# Altium project RGV_PCBA_1V21.PrjPcb (part 1 of 2)
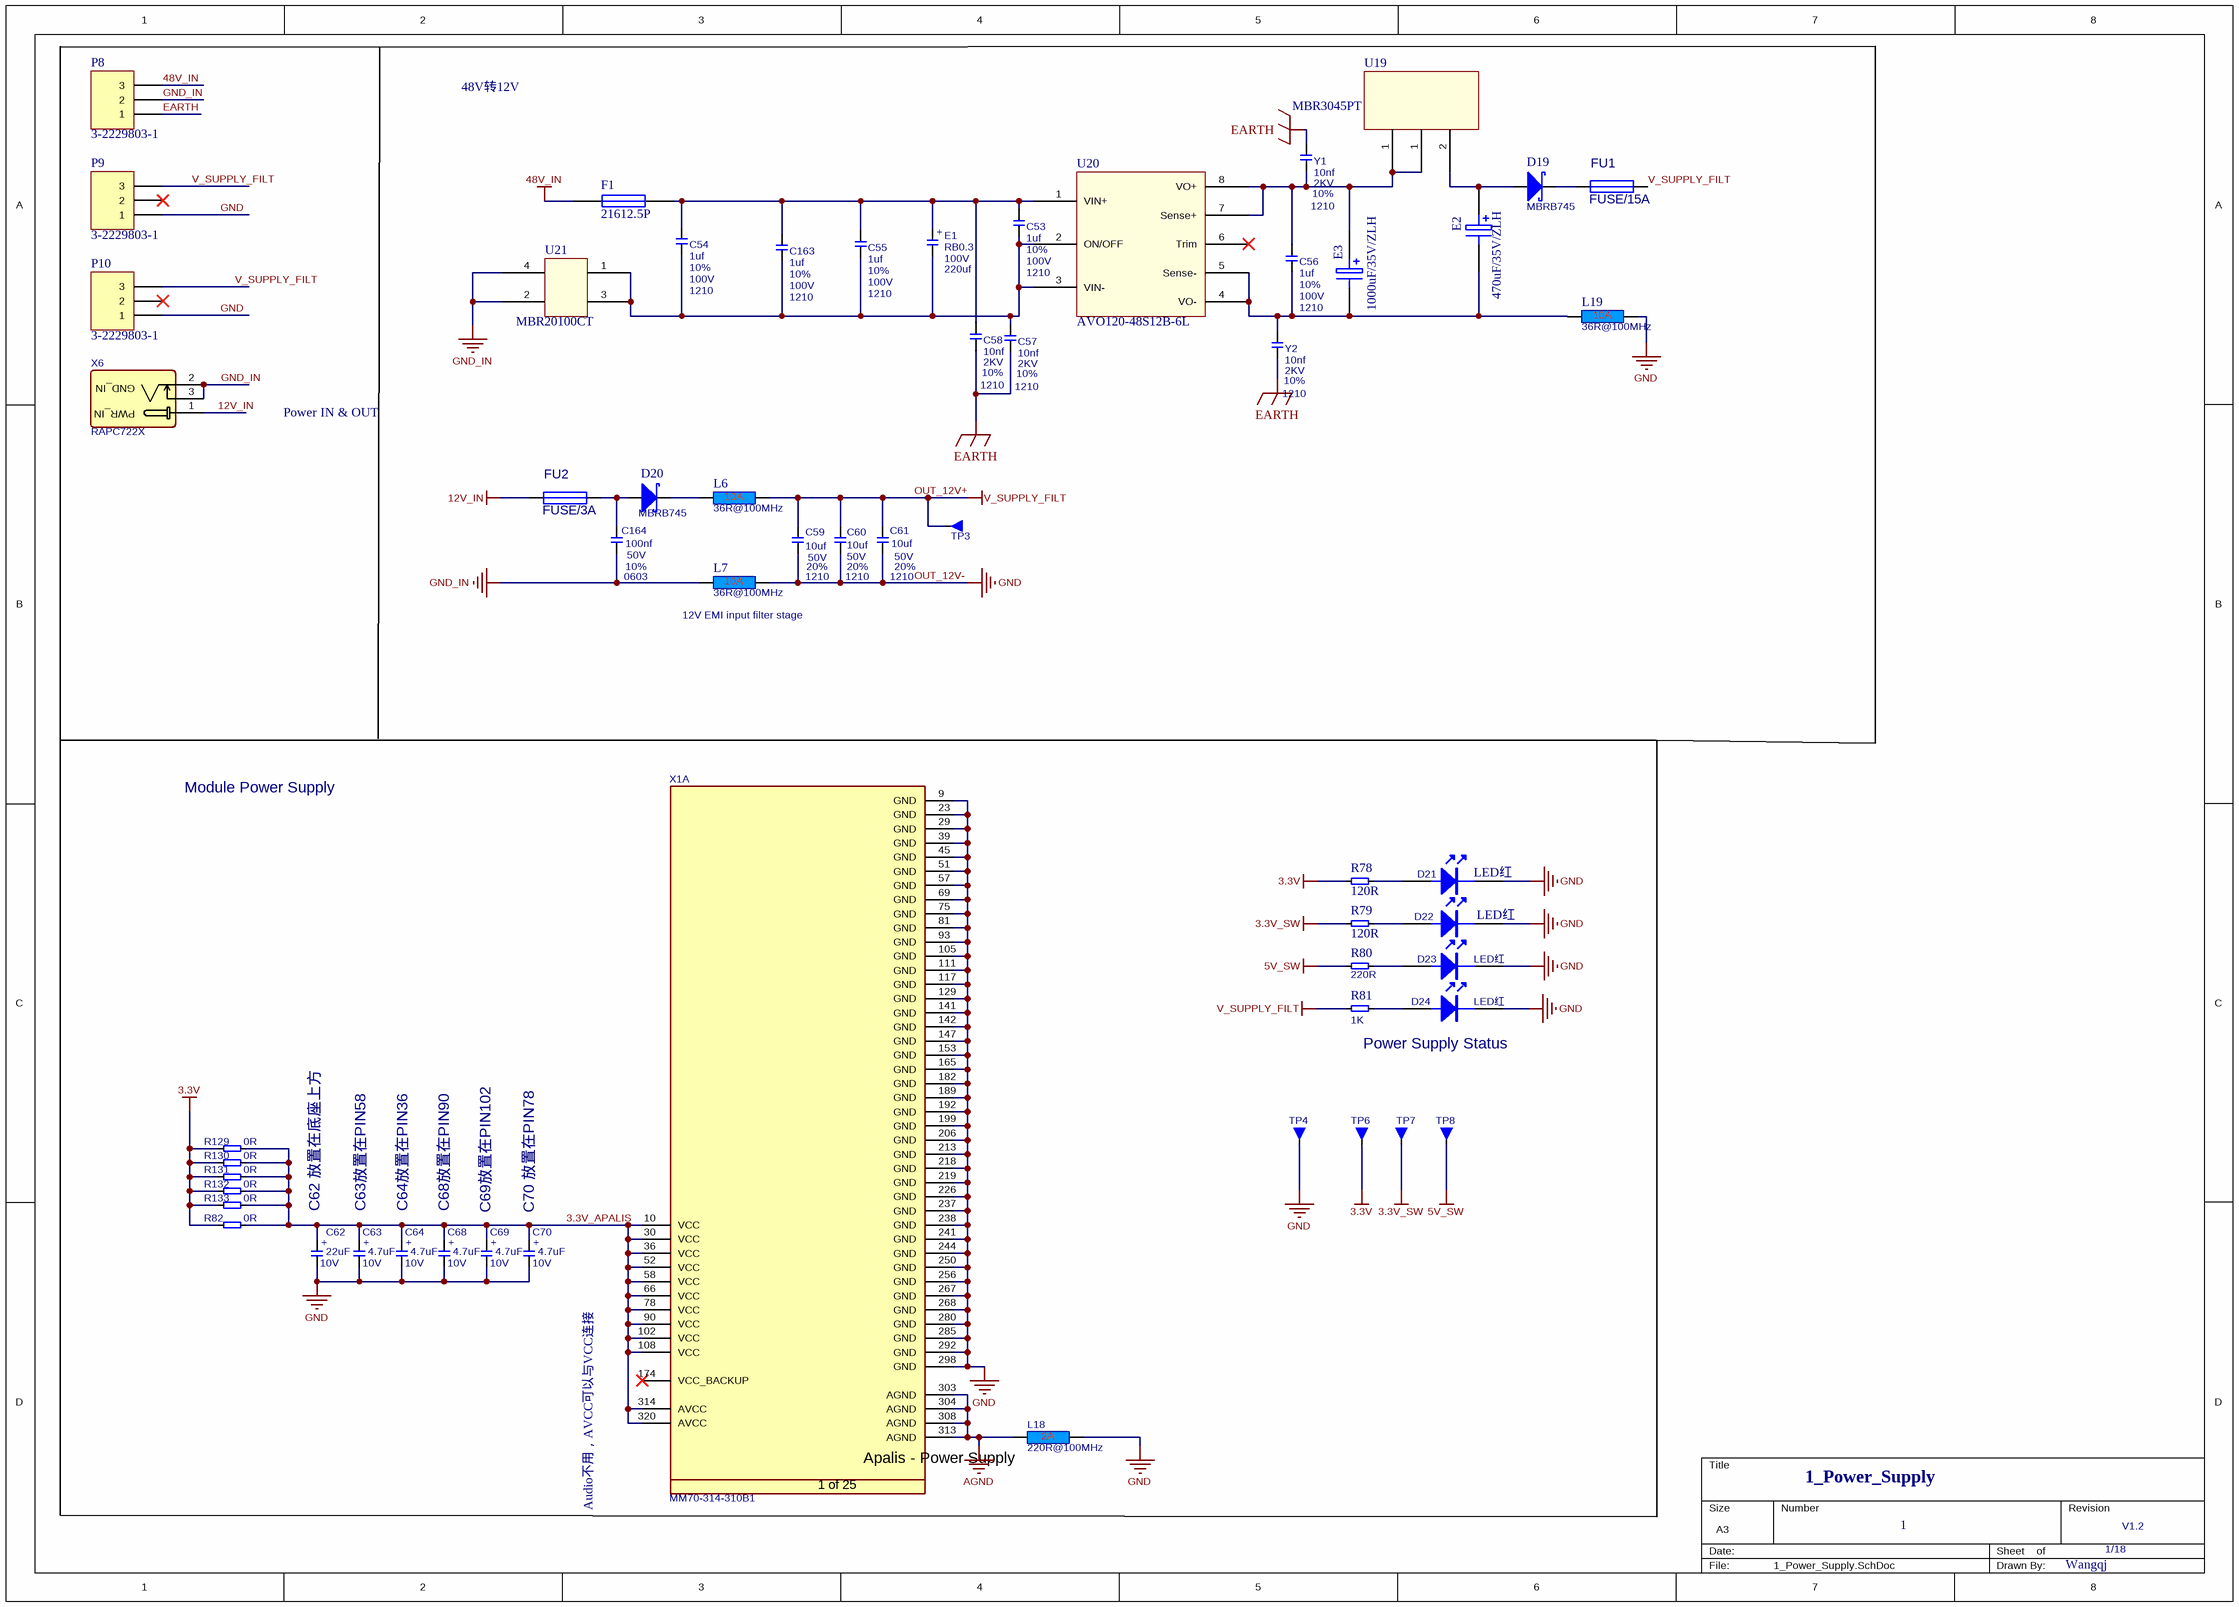
[diagram p0: 1_Power_Supply.SchDoc]
18 sheets, 529 parts. Net scope: global (net labels, ports and power ports of the same name join across sheets).
Board file: RGV_Control_1V21.PcbDoc
Sheets:
  1_Power_Supply.SchDoc
  2_Power_Switch.SchDoc
  3_RTC.SchDoc
  4_SDCard.SchDoc
  5_Ethernet.SchDoc
  6_CAN.SchDoc
  7_UART&RS485.SchDoc
  8_USB_Hub.SchDoc
  9_USB_Connectors.SchDoc
  10_RS232_1.SchDoc
  11_RS232_2.SchDoc
  12_NB-IOT_Core.SchDoc
  13_NB-IOT_Peripheral.SchDoc
  14_GPIOs_1.SchDoc
  15_GPIOs_2.SchDoc
  16_Analog&Audio.SchDoc
  17_I2C&SPI&SATA.SCHDOC
  18_VGA.SchDoc

## Sheet 1_Power_Supply.SchDoc: Apalis Evaluation Board 1.1
size A3; Organization: Toradex AG; Address1: Altsagenstrasse 5; Address2: Horw; Address3: 6048; Address4: Switzerland; DocumentNumber: 3; Revision: V1.1; SheetNumber: 3; SheetTotal: 32; PageSetup: Record=PageOptions|CenterHorizontal=True|CenterVertical=True|PrintScale=0.73|XCorrection=1.00|YCorrection=1.00|PrintKind=0|BorderSize=5000000|LeftOffset=0|BottomOffset=0|Orientation=2|PaperLength=1000|PaperWidth=1000|Scale=100|PaperSource=7|PrintQuality=-4|MediaType=1|DitherType=10|PaperKind=A4|PrintScaleMode=1

### Parts
C53  value 1uf  Tolerance: 10%  Rating: 100V  [1210]  (hidden comment: 1uf-100V-10%-1210)
C54  value 1uf  Tolerance: 10%  Rating: 100V  [1210]  (hidden comment: 1uf-100V-10%-1210)
C55  value 1uf  Tolerance: 10%  Rating: 100V  [1210]  (hidden comment: 1uf-100V-10%-1210)
C56  value 1uf  Tolerance: 10%  Rating: 100V  [1210]  (hidden comment: 1uf-100V-10%-1210)
C57  value 10nf  Tolerance: 10%  Rating: 2KV  [1210]  (hidden comment: 10nf-2KV-10%-1210)
C58  value 10nf  Tolerance: 10%  Rating: 2KV  [1210]  (hidden comment: 10nf-2KV-10%-1210)
C59  value 10uf  Tolerance: 20%  Rating: 50V  Footprint: 1210  [CAPC3225X160N]  (hidden comment: 10uf-50V-20%-1210-X5R)
C60  value 10uf  Tolerance: 20%  Rating: 50V  Footprint: 1210  [CAPC3225X160N]  (hidden comment: 10uf-50V-20%-1210-X5R)
C61  value 10uf  Tolerance: 20%  Rating: 50V  Footprint: 1210  [CAPC3225X160N]  (hidden comment: 10uf-50V-20%-1210-X5R)
C62  Rating: 10V  [CAPMP3528X210N]  (hidden comment: 22uF)
C63  Rating: 10V  [T_CAPMP3216X180N]  (hidden comment: 4.7uF)
C64  Rating: 10V  [T_CAPMP3216X180N]  (hidden comment: 4.7uF)
C68  Rating: 10V  [T_CAPMP3216X180N]  (hidden comment: 4.7uF)
C69  Rating: 10V  [T_CAPMP3216X180N]  (hidden comment: 4.7uF)
C70  Rating: 10V  [T_CAPMP3216X180N]  (hidden comment: 4.7uF)
C163  value 1uf  Tolerance: 10%  Rating: 100V  [1210]  (hidden comment: 1uf-100V-10%-1210)
C164  value 100nf  Tolerance: 10%  Rating: 50V  Footprint: 0603  [T_CAPC0603X33N]  (hidden comment: 100nf-50V-10%-0603-X7R)
D19  Manufacturer Part No.: MBRB745  [T_VISHAY_MBRB735PBF]  (hidden comment: MBRB735PBF)
D20  MBRB745  [T_VISHAY_MBRB735PBF]
D21  LED红  [LC-0805_LED_S3]
D22  LED红  [LC-0805_LED_S3]
D23  LED红  [LC-0805_LED_S3]
D24  LED红  [LC-0805_LED_S3]
E1  value 220uf  Footprint: RB0.3  Rating: 100V  [5*13]  (hidden comment: 220uf-100V-RB0.3)
E2  470uF/35V/ZLH  [RB0.3]
E3  1000uF/35V/ZLH  [5*13]
F1  21612.5P  [RAD0.3]
FU1  FUSE/15A  [FUSE-1808-3A]
FU2  FUSE/3A  [FUSE-1808-3A]
L6  36R@100MHz  [T_Laird_35F0121-0SR-10]
L7  36R@100MHz  [T_Laird_35F0121-0SR-10]
L18  220R@100MHz  [INDC1608X95N]
L19  36R@100MHz  [T_Laird_35F0121-0SR-10]
P8  3-2229803-1  [3-2229803-1]
P9  3-2229803-1  [3-2229803-1]
P10  3-2229803-1  [3-2229803-1]
R78  120R  [T_RESC0603X30N]
R79  120R  [T_RESC0603X30N]
R80  220R  [T_RESC0603X30N]
R81  1K  [T_RESC0603X30N]
R82  0R  [T_RESC3216X760N]
R129  0R  [T_RESC3216X760N]
R130  0R  [T_RESC3216X760N]
R131  0R  [T_RESC3216X760N]
R132  0R  [T_RESC3216X760N]
R133  0R  [T_RESC3216X760N]
TP3  Testpin  [T_TP-THT]  (value not drawn)
TP4  Testpin  [T_TP-THT]  (value not drawn)
TP6  Testpin  [T_TP-THT]  (value not drawn)
TP7  Testpin  [T_TP-THT]  (value not drawn)
TP8  Testpin  [T_TP-THT]  (value not drawn)
U19  MBR3045PT  [TO-3P]
U20  AVO120-48S12B-6L  [AVO120-48S12B-6L]
U21  MBR20100CT  [TO-220]
X1  Manufacturer Part No.: MM70-314-310B1  [T_JAE_MM70-314-310B1]  (hidden comment: CON-JAE-MM70-314-310B1-314-0.5mm)  (part A of 25)
X6  RAPC722X  [DC-005]
Y1  value 10nf  Tolerance: 10%  Rating: 2KV  [1210]  (hidden comment: 10nf-2KV-10%-1210)
Y2  value 10nf  Tolerance: 10%  Rating: 2KV  [1210]  (hidden comment: 10nf-2KV-10%-1210)

### Nets
3.3V: R78.1 R82.1 R129.1 R130.1 R131.1 R132.1 R133.1 TP6.1
3.3V_SW: R79.1 TP7.1
5V_SW: R80.1 TP8.1
12V_IN: FU2.1 X6.1(GND_IN)
48V_IN: F1.1 P8.3
AGND: L18.1 X1.303(AGND) X1.304(AGND) X1.308(AGND) X1.313(AGND)
EARTH: C57.1 C58.1 P8.1 Y1.2 Y2.1
GND: C59.1 C60.1 C61.1 C62.2 C63.2 C64.2 C68.2 C69.2 C70.2 D21.K D22.K D23.K D24.K L7.2 L18.2 L19.2 P9.1 P10.1 TP4.1 X1.9(GND) X1.23(GND) X1.29(GND) X1.39(GND) X1.45(GND) X1.51(GND) X1.57(GND) X1.69(GND) X1.75(GND) X1.81(GND) X1.93(GND) X1.105(GND) X1.111(GND) X1.117(GND) X1.129(GND) X1.141(GND) X1.142(GND) X1.147(GND) X1.153(GND) X1.165(GND) X1.182(GND) X1.189(GND) X1.192(GND) X1.199(GND) X1.206(GND) X1.213(GND) X1.218(GND) X1.219(GND) X1.226(GND) X1.237(GND) X1.238(GND) X1.241(GND) X1.244(GND) X1.250(GND) X1.256(GND) X1.267(GND) X1.268(GND) X1.280(GND) X1.285(GND) X1.292(GND) X1.298(GND)  [also labelled OUT_12V-]
GND_IN: C164.1 L7.1 P8.2 U21.2 U21.4 X6.2(PWR_IN) X6.3(PWR_IN)
OUT_12V+: C59.2 C60.2 C61.2 FU1.2 L6.2 P9.3 P10.3 R81.1 TP3.1  [also labelled V_SUPPLY_FILT]
3.3V_APALIS: C62.1 C63.1 C64.1 C68.1 C69.1 C70.1 R82.2 R129.2 R130.2 R131.2 R132.2 R133.2 X1.10(VCC) X1.30(VCC) X1.36(VCC) X1.52(VCC) X1.58(VCC) X1.66(VCC) X1.78(VCC) X1.90(VCC) X1.102(VCC) X1.108(VCC) X1.314(AVCC) X1.320(AVCC)
NetC53_1: C53.1 C54.1 C55.1 C57.2 C163.1 E1.2 U20.2(ON/OFF) U20.3(VIN-) U21.1 U21.3
NetC53_2: C53.2 C54.2 C55.2 C58.2 C163.2 E1.1 F1.2 U20.1(VIN+)
NetC56_1: C56.1 E2.2 E3.2 L19.1 U20.4(VO-) U20.5(Sense-) Y2.2
NetC56_2: C56.2 E3.1 U19.1 U20.7(Sense+) U20.8(VO+) Y1.1
NetC164_2: C164.2 D20.3 FU2.2
NetD19_2: D19.2 FU1.1
NetD19_3: D19.3 E2.1 U19.2
NetD20_2: D20.2 L6.1
NetD21_A: D21.A R78.2
NetD22_A: D22.A R79.2
NetD23_A: D23.A R80.2
NetD24_A: D24.A R81.2

Not connected (* = marked no-connect by the designer): P9 2*; P10 2*; U20 6(Trim)*; X1 174(VCC_BACKUP)*

### Notes on the sheet
- 48V转12V
- Power IN & OUT
- (near L7) 12V EMI input filter stage
- Module Power Supply
- Power Supply Status
- C62 放置在底座上方
- C63放置在PIN58
- C64放置在PIN36
- C68放置在PIN90
- C69放置在PIN102
- C70 放置在PIN78
- 1_Power_Supply
- Audio不用，AVCC可以与VCC连接
- 1
- 1/18
- V1.2
- Wangqj
- Title
- Size:
- Date:
- A3
- Number:
- Time:
- Revision:
- Sheet
- of
- File:
- (in symbol C-TA) +
- (in symbol C-TA-4.7uF-10V-20%-3216) +
- (in symbol C-TA-22uF-10V-20%-3528) +
- (in symbol CON-JAE-MM70-314-310B1-314-0.5mm, part A) Apalis - Power Supply; 1 of 25

### Library data of the parts
C53-C58 C163 = C-Ceramic: 33pf-50V-5%-0603; Type: X7R
C59-C61 = C-10uF-50V-20%-1210-X5R: Capacitor Ceramic X5R 10uF 50V 20% 1210; Type: X5R
C62 = C-TA-22uF-10V-20%-3528: Capacitor TA 22uF 10V 20% 3528; Tolerance: 20%; Type: TA; Value: 22uF
C63 C64 C68-C70 = C-TA-4.7uF-10V-20%-3216: Capacitor TA 4.7uF 10V 20% 3216; Tolerance: 20%; Type: TA; Value: 4.7uF
C164 = C-100nF-50V-20%-0603-X7R: Capacitor Ceramic X7R 100nF 50V 20% 0603; Type: X7R
D19 D20 = D-VISHAY-MBRB735PBF: MBRB735PBF Schottky Diode; Manufacturer Name: Vishay
  D20: Manufacturer Part No.: MBRB745
D21-D24 = LED: 0805LED红
E1 = C-TA: Capacitor TA; Tolerance: 20%; Type: TA
E2 E3 = ELECTRO1: 插装电解电容
F1 = FUSE1: 直插12.5A保险丝
FU1 = FUSE: 贴片15A保险
FU2 = FUSE: 贴片3A保险
L6 L7 L19 = L-Laird-35F0121-0SR-10-10A-25%: Power Supply FB 10A; Tolerance: 25%; Rating: 10A; Value: 36R@100MHz
L18 = L-220R@100MHz-2A-25%-0603: 220R@100MHz 2A EMI FILTER; Tolerance: 25%; Rating: 2A; Value: 220R@100MHz
P8-P10 = Header 3: 泰科电源端子座; LatestRevisionDate: 17-Jul-2002; LatestRevisionNote: Re-released for DXP Platform.; Publisher: Altium Limited
R78 R79 = R-120R-63mW-5%-0603: Resistor 120 ohm 63mW 5% 0603; Rating: 63mW; Tolerance: 5%; Value: 120R
R80 = R-220R-63mW-5%-0603: Resistor 220 ohm 63mW 5% 0603; Rating: 63mW; Tolerance: 5%; Value: 220R
R81 = R-1KR-63mW-5%-0603: Resistor 1 Kohm 63mW 5% 0603; Rating: 63mW; Tolerance: 5%; Value: 1K
R82 = R-0R-63mW-1%-1206: Resistor 0 ohm 330mW 1% 1206; Rating: 63mW; Tolerance: 1%; Value: 0R
R129-R133 = R-0R-63mW-1%-1206: Resistor 0 ohm 63mW 1% 1206; Rating: 63mW; Tolerance: 1%; Value: 0R
TP3 TP4 TP6-TP8 = Testpin: Testpin TH
U19 = MBR3045T: 插装肖特基二极管，加散热片
U20 = AVO120-48S12B-6L: 嵌入式48-12V电源模块
X1 = CON-JAE-MM70-314-310B1-314-0.5mm: MXM3 Connector; Manufacturer Name: JAE; No. of ways: 314
X6 = CON-SWC-RAPC722X: Power Jack; Manufacturer Name: SWC; Manufacturer Part No.: RAPC722X
Y1 Y2 = C-Ceramic: 33pf-50V-5%-0603; Type: X7R

## Sheet 2_Power_Switch.SchDoc: Apalis Evaluation Board 1.1
size A3; Organization: Toradex AG; Address1: Altsagenstrasse 5; Address2: Horw; Address3: 6048; Address4: Switzerland; DocumentNumber: 4; Revision: V1.1; SheetNumber: 4; SheetTotal: 32; PageSetup: Record=PageOptions|CenterHorizontal=True|CenterVertical=True|PrintScale=0.73|XCorrection=1.00|YCorrection=1.00|PrintKind=0|BorderSize=5000000|LeftOffset=0|BottomOffset=0|Orientation=2|PaperLength=1000|PaperWidth=1000|Scale=100|PaperSource=7|PrintQuality=-4|MediaType=1|DitherType=10|PaperKind=A4|PrintScaleMode=1
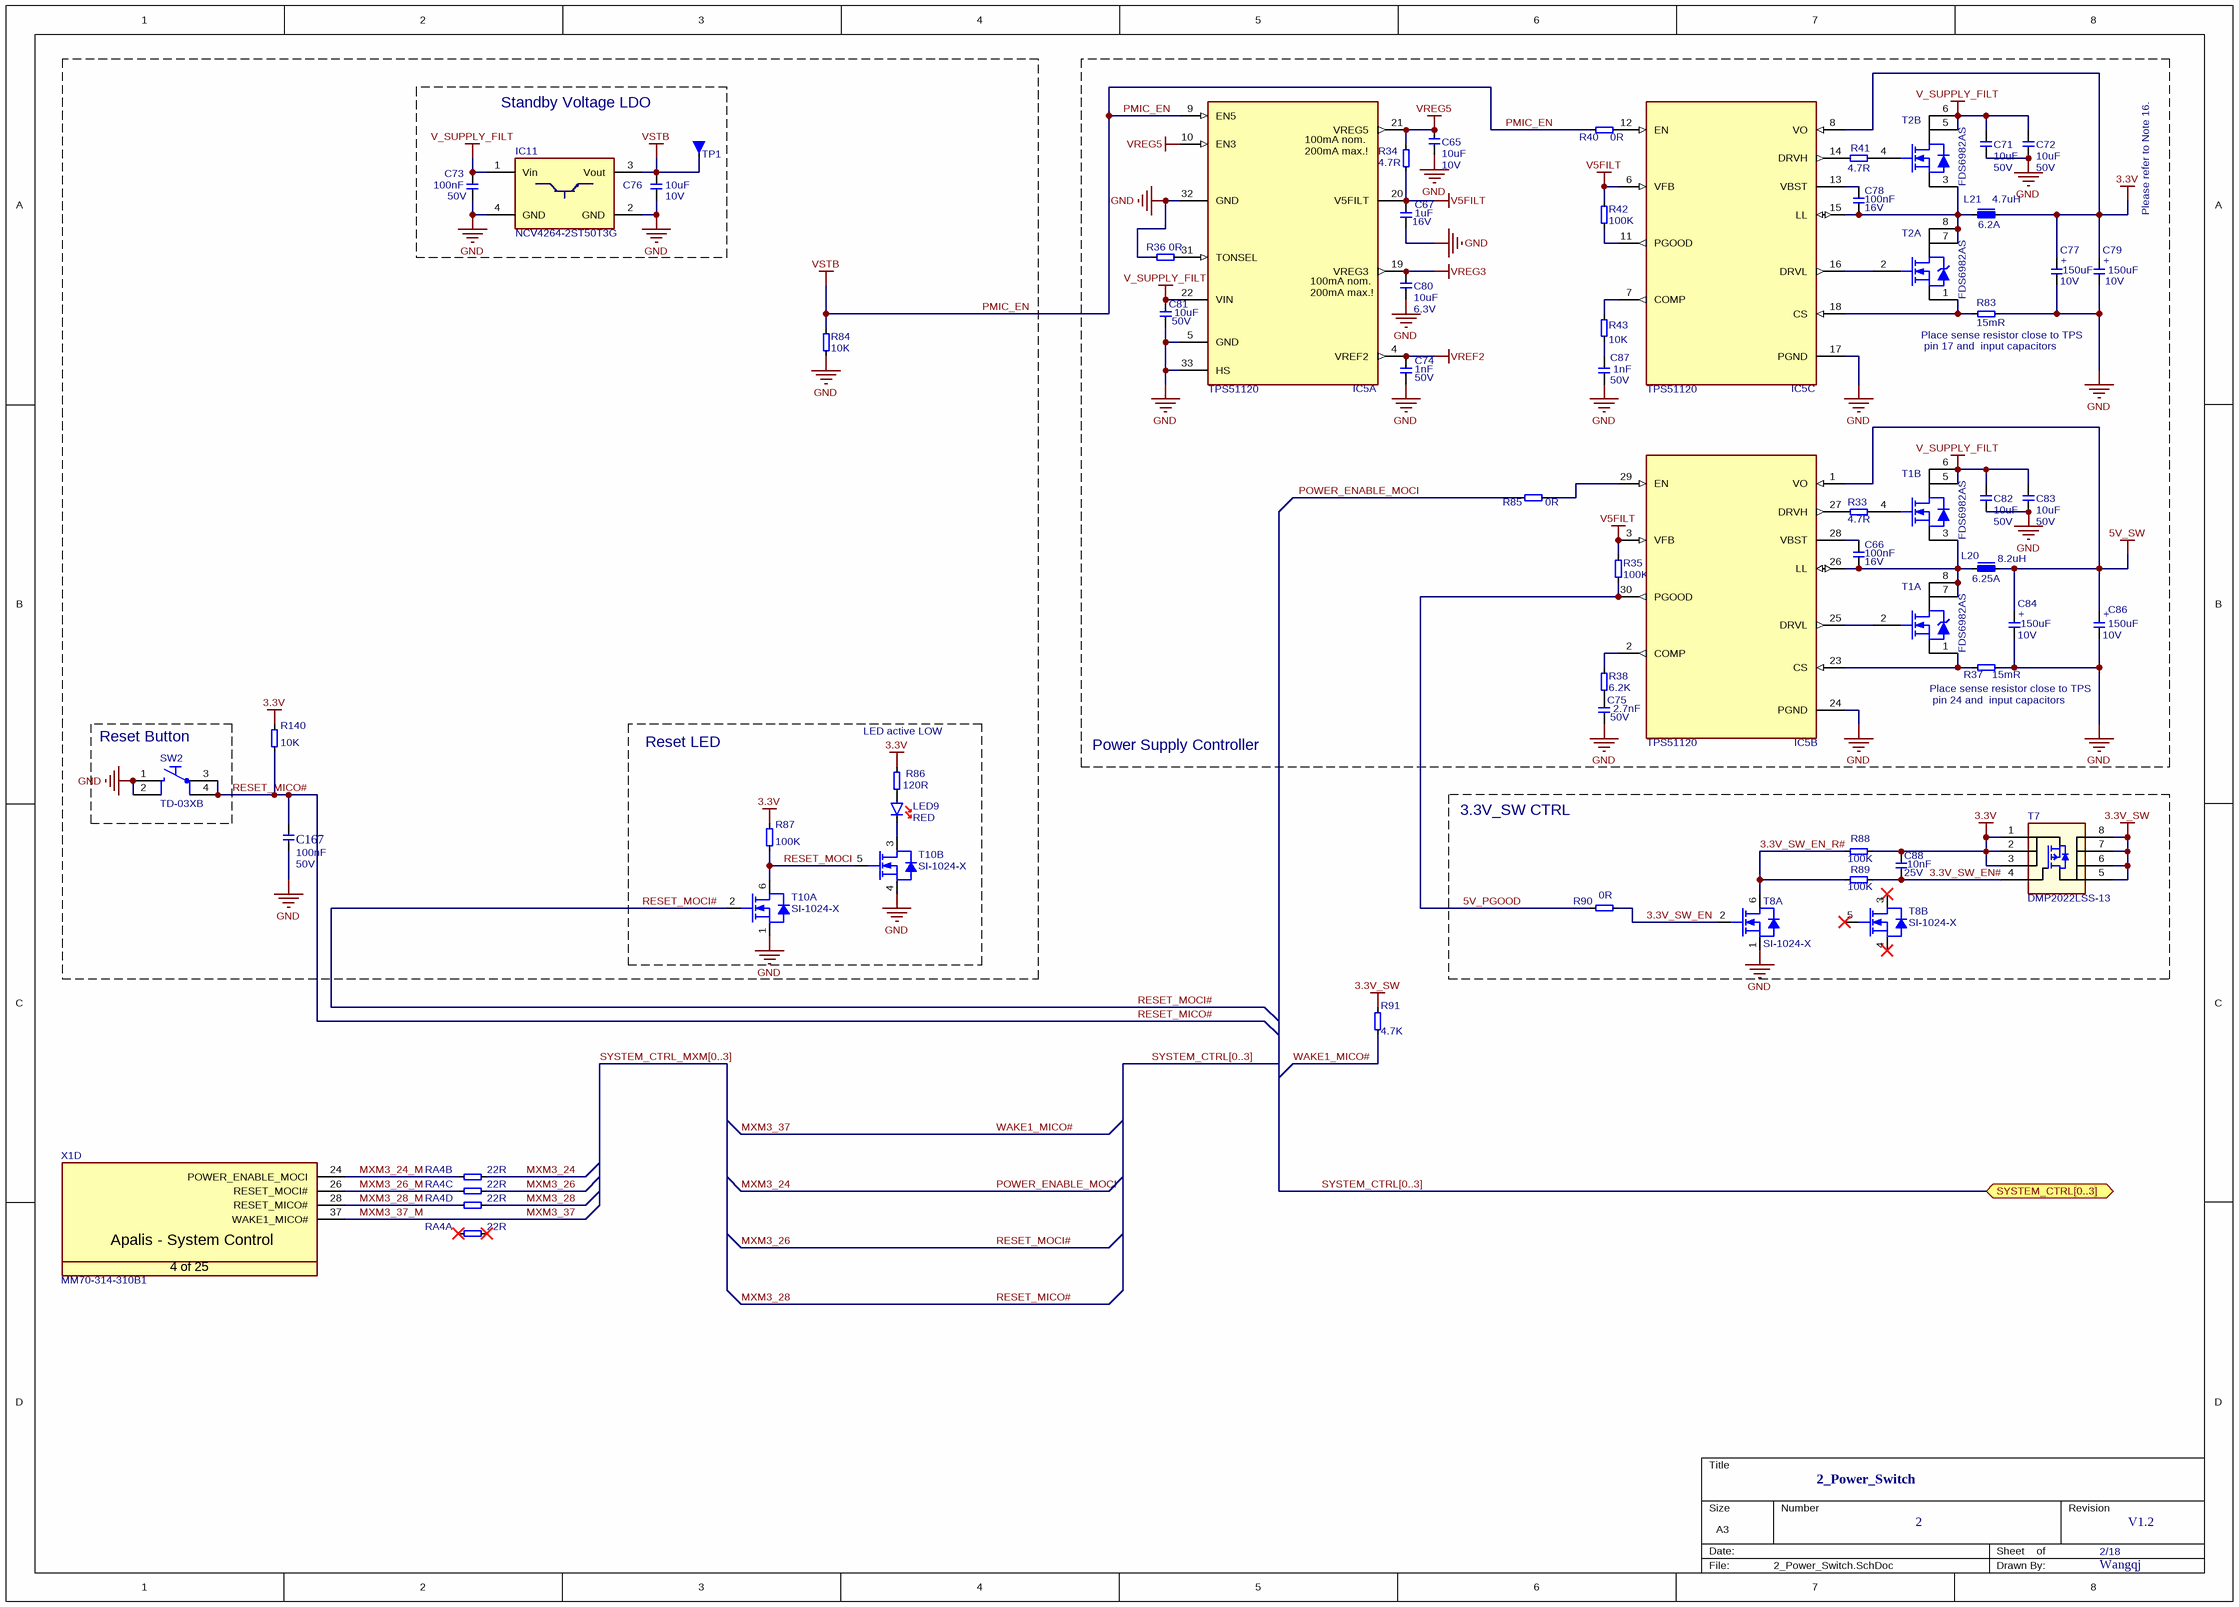
[diagram p1: 2_Power_Switch.SchDoc]

### Parts
C65  Rating: 10V  [T_CAPC0805X125N]  (hidden comment: 10uF)
C66  Rating: 16V  [T_CAPC0603X33N]  (hidden comment: 100nF)
C67  Rating: 16V  [T_CAPC0603X33N]  (hidden comment: 1uF)
C71  Rating: 50V  [CAPC3225X160N]  (hidden comment: 10uF)
C72  Rating: 50V  [CAPC3225X160N]  (hidden comment: 10uF)
C73  Rating: 50V  [T_CAPC0603X33N]  (hidden comment: 100nF)
C74  Rating: 50V  [T_CAPC0603X33N]  (hidden comment: 1nF)
C75  Rating: 50V  [CAPC1005X60N]  (hidden comment: 2.7nF)
C76  Rating: 10V  [T_CAPC0805X125N]  (hidden comment: 10uF)
C77  Rating: 10V  [CAPMP7343X310N]  (hidden comment: 150uF)
C78  Rating: 16V  [T_CAPC0603X33N]  (hidden comment: 100nF)
C79  Rating: 10V  [CAPMP7343X310N]  (hidden comment: 150uF)
C80  Rating: 6.3V  [T_CAPC0603X33N]  (hidden comment: 10uF)
C81  Rating: 50V  [CAPC3225X160N]  (hidden comment: 10uF)
C82  Rating: 50V  [CAPC3225X160N]  (hidden comment: 10uF)
C83  Rating: 50V  [CAPC3225X160N]  (hidden comment: 10uF)
C84  Rating: 10V  [CAPMP7343X310N]  (hidden comment: 150uF)
C86  Rating: 10V  [CAPMP7343X310N]  (hidden comment: 150uF)
C87  Rating: 50V  [T_CAPC0603X33N]  (hidden comment: 1nF)
C88  Rating: 25V  [T_CAPC0603X33N]  (hidden comment: 10nF)
C167  Rating: 50V  [T_CAPC0603X33N]  (hidden comment: 100nF)
IC5  TPS51120  [QFN50P500X500X100-33N]  (parts A,B,C of 3)
IC11  NCV4264-2ST50T3G  [T_ON_NCV4264-2ST50T3G]
L20  Rating: 6.25A  [T_INDM120120X80N]  (hidden comment: 8.2uH)
L21  Rating: 6.2A  [T_INDM102102X45N]  (hidden comment: 4.7uH)
LED9  Color: RED  [LC-0805_LED_S3]  (hidden comment: LS T670-K1L2-1)
R33  4.7R  [RESC1005X40N]
R34  4.7R  [RESC1005X40N]
R35  100K  [T_RESC0603X30N]
R36  0R  [T_RESC0603X30N]
R37  15mR  [RESC3316X76N]
R38  6.2K  [RESC1005X40N]
R40  0R  [T_RESC0603X30N]
R41  4.7R  [RESC1005X40N]
R42  100K  [T_RESC0603X30N]
R43  10K  [T_RESC0603X30N]
R83  15mR  [RESC3316X76N]
R84  10K  [T_RESC0603X30N]
R85  0R  [T_RESC0603X30N]
R86  120R  [T_RESC0603X30N]
R87  100K  [T_RESC0603X30N]
R88  100K  [T_RESC0603X30N]
R89  100K  [T_RESC0603X30N]
R90  0R  [T_RESC0603X30N]
R91  4.7K  [t_RESC0603X30N]
R140  10K  [0805R]
RA4  22R  [T_Resistor_Array_X4]  (parts A,B,C,D of 4)
SW2  TD-03XB  [T_WMF_TD-03XB]
T1  FDS6982AS  [SOIC127P600X173-8N]  (parts A,B of 2)
T2  FDS6982AS  [SOIC127P600X173-8N]  (parts A,B of 2)
T7  DMP2022LSS-13  [SOIC127P600X173-8N]
T8  Manufacturer Part No.: SI-1024-X  [SOTFL50P160X60-6N]  (hidden comment: T-Vishay-SI-1024X-N)  (parts A,B of 2)
T10  Manufacturer Part No.: SI-1024-X  [SOTFL50P160X60-6N]  (hidden comment: T-Vishay-SI-1024X-N)  (parts A,B of 2)
TP1  Testpin  [T_TP-THT]  (value not drawn)
X1  Manufacturer Part No.: MM70-314-310B1  [T_JAE_MM70-314-310B1]  (hidden comment: CON-JAE-MM70-314-310B1-314-0.5mm)  (part D of 25)

### Blocks framed on the sheet
LED active LOW: C167 R84 R140
Power Supply Controller: C65-C67 C71 C72 C74 C75 C77-C84 C86 C87 IC5 L20 L21 R33-R38 R40-R43 R83 R85 T1 T2
Standby Voltage LDO: C73 C76 IC11 TP1
Reset Button: SW2
Reset LED: LED9 R86 R87 T10
3.3V_SW CTRL: C88 R88-R90 T7 T8

### Ports
SYSTEM_CTRL[0..3] (bidir)

### Nets
3.3V: C77.1 C79.1 C88.2 IC5.8(VO) L21.2 R86.2 R87.2 R88.1 R140.2 T7.1(S) T7.2(S) T7.3(S)
3.3V_SW: R91.1 T7.5(D) T7.6(D) T7.7(D) T7.8(D)
5V_SW: C84.1 C86.1 IC5.1(VO) L20.2
GND: C65.1 C67.1 C71.1 C72.1 C73.1 C74.1 C75.1 C76.1 C77.2 C79.2 C80.1 C81.1 C82.1 C83.1 C84.2 C86.2 C87.1 C167.1 IC5.5(GND) IC5.17(PGND) IC5.24(PGND) IC5.32(GND) IC5.33(HS) IC11.2(GND) IC11.4(GND) R36.1 R37.2 R83.2 R84.1 SW2.1 SW2.2 T8.1(S) T10.1(S) T10.4(S)
PMIC_EN: C76.2 IC5.9(EN5) IC11.3(Vout) R40.1 R84.2 TP1.1  [also labelled VSTB]
V5FILT: C67.2 IC5.3(VFB) IC5.6(VFB) IC5.20(V5FILT) R34.1 R35.2 R42.2
V_SUPPLY_FILT: C71.2 C72.2 C73.2 C81.2 C82.2 C83.2 IC5.22(VIN) IC11.1(Vin) T1.5(D) T1.6(D) T2.5(D) T2.6(D)  [project net OUT_12V+]
VREF2: C74.2 IC5.4(VREF2)
VREG3: C80.2 IC5.19(VREG3)
VREG5: C65.2 IC5.10(EN3) IC5.21(VREG5) R34.2
3.3V_SW_EN: R90.1 T8.2(G)
3.3V_SW_EN#: C88.1 R89.1 T7.4(G)
3.3V_SW_EN_R#: R88.2 R89.2 T8.6(D)
5V_PGOOD: IC5.30(PGOOD) R35.1 R90.2
MXM3_24: R85.1 RA4.6  [also labelled POWER_ENABLE_MOCI]
MXM3_24_M: RA4.2 X1.24(POWER_ENABLE_MOCI)
MXM3_26: RA4.7 T10.2(G)  [also labelled RESET_MOCI#]
MXM3_26_M: RA4.3 X1.26(RESET_MOCI#)
MXM3_28: C167.2 R140.1 RA4.8 SW2.3 SW2.4  [also labelled RESET_MICO#]
MXM3_28_M: RA4.4 X1.28(RESET_MICO#)
MXM3_37: R91.2 X1.37(WAKE1_MICO#)  [also labelled MXM3_37_M, WAKE1_MICO#]
RESET_MOCI: R87.1 T10.5(G) T10.6(D)
NetC66_1: C66.1 IC5.26(LL) L20.1 T1.3(S) T1.7(D) T1.8(D)
NetC66_2: C66.2 IC5.28(VBST)
NetC75_2: C75.2 R38.1
NetC78_1: C78.1 IC5.15(LL) L21.1 T2.3(S) T2.7(D) T2.8(D)
NetC78_2: C78.2 IC5.13(VBST)
NetC87_2: C87.2 R43.1
NetIC5_2: IC5.2(COMP) R38.2
NetIC5_7: IC5.7(COMP) R43.2
NetIC5_11: IC5.11(PGOOD) R42.1
NetIC5_12: IC5.12(EN) R40.2
NetIC5_14: IC5.14(DRVH) R41.1
NetIC5_16: IC5.16(DRVL) T2.2(G)
NetIC5_18: IC5.18(CS) R83.1 T2.1(S)
NetIC5_23: IC5.23(CS) R37.1 T1.1(S)
NetIC5_25: IC5.25(DRVL) T1.2(G)
NetIC5_27: IC5.27(DRVH) R33.1
NetIC5_29: IC5.29(EN) R85.2
NetIC5_31: IC5.31(TONSEL) R36.2
NetLED9_A: LED9.A R86.1
NetLED9_K: LED9.K T10.3(D)
NetR33_2: R33.2 T1.4(G)
NetR41_2: R41.2 T2.4(G)

Not connected (* = marked no-connect by the designer): RA4 1* 5*; T8 3(D)* 4(S)* 5(G)*

### Buses and harness runs
bus SYSTEM_CTRL[0..3] = port SYSTEM_CTRL[0..3]
bus SYSTEM_CTRL_MXM[0..3]

### Notes on the sheet
- Please refer to Note 16.
- (near R83) Place sense resistor close to TPS
- pin 17 and  input capacitors
- (near R37) Place sense resistor close to TPS
- pin 24 and  input capacitors
- 2_Power_Switch
- 2
- 2/18
- V1.2
- Wangqj
- Title
- Size:
- Date:
- A3
- Number:
- Time:
- Revision:
- Sheet
- of
- File:
- (in symbol C-TA-150uF-10V-10%-7343) +
- (in symbol CON-JAE-MM70-314-310B1-314-0.5mm, part D) Apalis - System Control; 4 of 25
- (in symbol IC-TI-TPS51120, part A) 100mA nom.; 200mA max.!

### Library data of the parts
C65 C76 = C-X5R-10uF-10V-20%-0805: Capacitor Ceramic X5R 10uF 10V 20% 0805; Tolerance: 20%; Type: X5R; Value: 10uF
C66 C78 = C-X7R-100nF-16V-10%-0603: Capacitor Ceramic X7R 100nF 16V 10% 0603; Tolerance: 10%; Type: X7R; Value: 100nF
C67 = C-X5R-1uF-16V-20%-0603: Capacitor Ceramic X5R 1uF 16V 20% 0603; Tolerance: 20%; Type: X5R; Value: 1uF
C71 C72 C81-C83 = C-X5R-10uF-50V-20%-1210: Capacitor Ceramic X5R 10uF 50V 20% 1210; Tolerance: 20%; Type: X5R; Value: 10uF
C73 = C-X7R-100nF-50V-20%-0603: Capacitor Ceramic X7R 100nF 50V 20% 0603; Tolerance: 20%; Type: X7R; Value: 100nF
C74 C87 = C-X7R-1nF-50V-10%-0603: Capacitor Ceramic X7R 1nF 50V 10% 0603; Tolerance: 10%; Type: X7R; Value: 1nF
C75 = C-X7R-2.7nF-50V-10%-0402: Capacitor Ceramic X7R 2.7nF 50V 10% 0402; Tolerance: 10%; Type: X7R; Value: 2.7nF
C77 C79 C84 C86 = C-TA-150uF-10V-10%-7343: Capacitor TA 150uF 10V 10% 7343; Tolerance: 10%; Type: TA; Value: 150uF
C80 = C-X5R-10uF-6.3V-20%-0603: Capacitor Ceramic X5R 10uF 6.3V 20% 0603; Tolerance: 20%; Type: X5R; Value: 10uF
C88 = C-X7R-10nF-25V-10%-0603: Capacitor Ceramic X7R 10nF 25V 10% 0603; Tolerance: 10%; Type: X7R; Value: 10nF
C167 = C-100nF-50V-20%-0603-X7R: Capacitor Ceramic X7R 100nF 50V 20% 0603; Tolerance: 20%; Type: X7R; Value: 100nF
IC5 = IC-TI-TPS51120: Power Supply Controller; Manufacturer Name: Texas Instruments; Manufacturer Part No.: TPS51120
IC11 = IC-ON-NCV4264-2ST50T3G: NCV4264-2ST50T3G LDO Regulator; Manufacturer Name: ON Semiconductor; Manufacturer Part No.: NCV4264-2ST50T3G
L20 = L-Wurth-744771008-8.2uH-6.25A-20%: Inductance 8.2uH 6.25A 20%; Manufacturer Name: Wurth; Tolerance: 20%; Manufacturer Part No.: 744771008; Value: 8.2uH
L21 = L-Wurth-7447797470-4.7uH-6.2A-20%: Inductance 4.7uH 6.2A 20%; Manufacturer Name: Wurth; Tolerance: 20%; Manufacturer Part No.: 7447797470; Value: 4.7uH
LED9 = LED-Osram-LS T670-K1L2-1: LED red, Osram LS T670-K1L2-1; Manufacturer Name: Osram; Manufacturer Part No.: LS T670-K1L2-1
R33 R34 R41 = R-4.7R-63mW-5%-0402: Resistor 4.7 ohm 63mW 5% 0402; Rating: 63mW; Tolerance: 5%; Value: 4.7R
R35 R42 R87-R89 = R-100KR-63mW-5%-0603: Resistor 100 Kohm 63mW 5% 0603; Value: 100KR; Rating: 63mW; Tolerance: 5%
R36 R40 R85 R90 = R-0R-63mW-1%-0603: Resistor 0 ohm 63mW 1% 0603; Rating: 63mW; Tolerance: 1%; Value: 0R
R37 R83 = R-15mR-250mW-1%-1206: Resistor 15 mohm 250mW 1% 1206; Rating: 250mW; Tolerance: 1%; Value: 15mR
R38 = R-6.2KR-63mW-1%-0402: Resistor 6.2 Kohm 63mW 1% 0402; Value: 6.2KR; Rating: 63mW; Tolerance: 1%
R43 = R-10KR-63mW-1%-0603: Resistor 10 Kohm 63mW 1% 0603; Value: 10KR; Rating: 63mW; Tolerance: 1%
R84 = R-10KR-63mW-5%-0603: Resistor 10 Kohm 63mW 5% 0603; Value: 10KR; Rating: 63mW; Tolerance: 5%
R86 = R-120R-63mW-5%-0603: Resistor 120 ohm 63mW 5% 0603; Rating: 63mW; Tolerance: 5%; Value: 120R
R91 = R-4.7kR-63mW-5%-0603: Resistor 4.7 Kohm 63mW 5% 0603; Value: 4.7KR; Rating: 63mW; Tolerance: 5%
R140 = R-100KR-63mW-5%-0603: Resistor 100 Kohm 63mW 5% 0603; Value: 10KR; Rating: 63mW; Tolerance: 5%
RA4 = RA-22R-63mW-5%-1206-div: Resistor Array 22 R 63mW 5% 1206; Tolerance: 5%; Power Dissipation: 63mW; Value: 22R
SW2 = SW-WMF-TD-03XB: Push Button; Manufacturer Name: WMF; Rating: 50mA; Manufacturer Part No.: TD-03XB
T1 T2 = T-Fairchild-FDS6982AS-N: N-Channel PowerTrench SyncFET; Manufacturer Name: Fairchild; Manufacturer Part No.: FDS6982AS
T7 = T-Diodes-DMP2022LSS-13-8-SOIC: p-channel MOSFET, DMP2022LSS-13; Manufacturer Name: DIODES; Manufacturer Part No.: DMP2022LSS-13
T8 T10 = T-Vishay-SI-1024X-N: Dual N-Channel 20V (D-S)  MOSFET; Manufacturer Name: Vishay
TP1 = Testpin: Testpin TH
X1 = CON-JAE-MM70-314-310B1-314-0.5mm: as X1 on sheet 1_Power_Supply

## Sheet 3_RTC.SchDoc: Apalis Evaluation Board 1.1
size A3; Organization: Toradex AG; Address1: Altsagenstrasse 5; Address2: Horw; Address3: 6048; Address4: Switzerland; DocumentNumber: 5; Revision: V1.1; SheetNumber: 5; SheetTotal: 32; PageSetup: Record=PageOptions|CenterHorizontal=True|CenterVertical=True|PrintScale=0.73|XCorrection=1.00|YCorrection=1.00|PrintKind=0|BorderSize=5000000|LeftOffset=0|BottomOffset=0|Orientation=2|PaperLength=1000|PaperWidth=1000|Scale=100|PaperSource=7|PrintQuality=-4|MediaType=1|DitherType=10|PaperKind=A4|PrintScaleMode=1
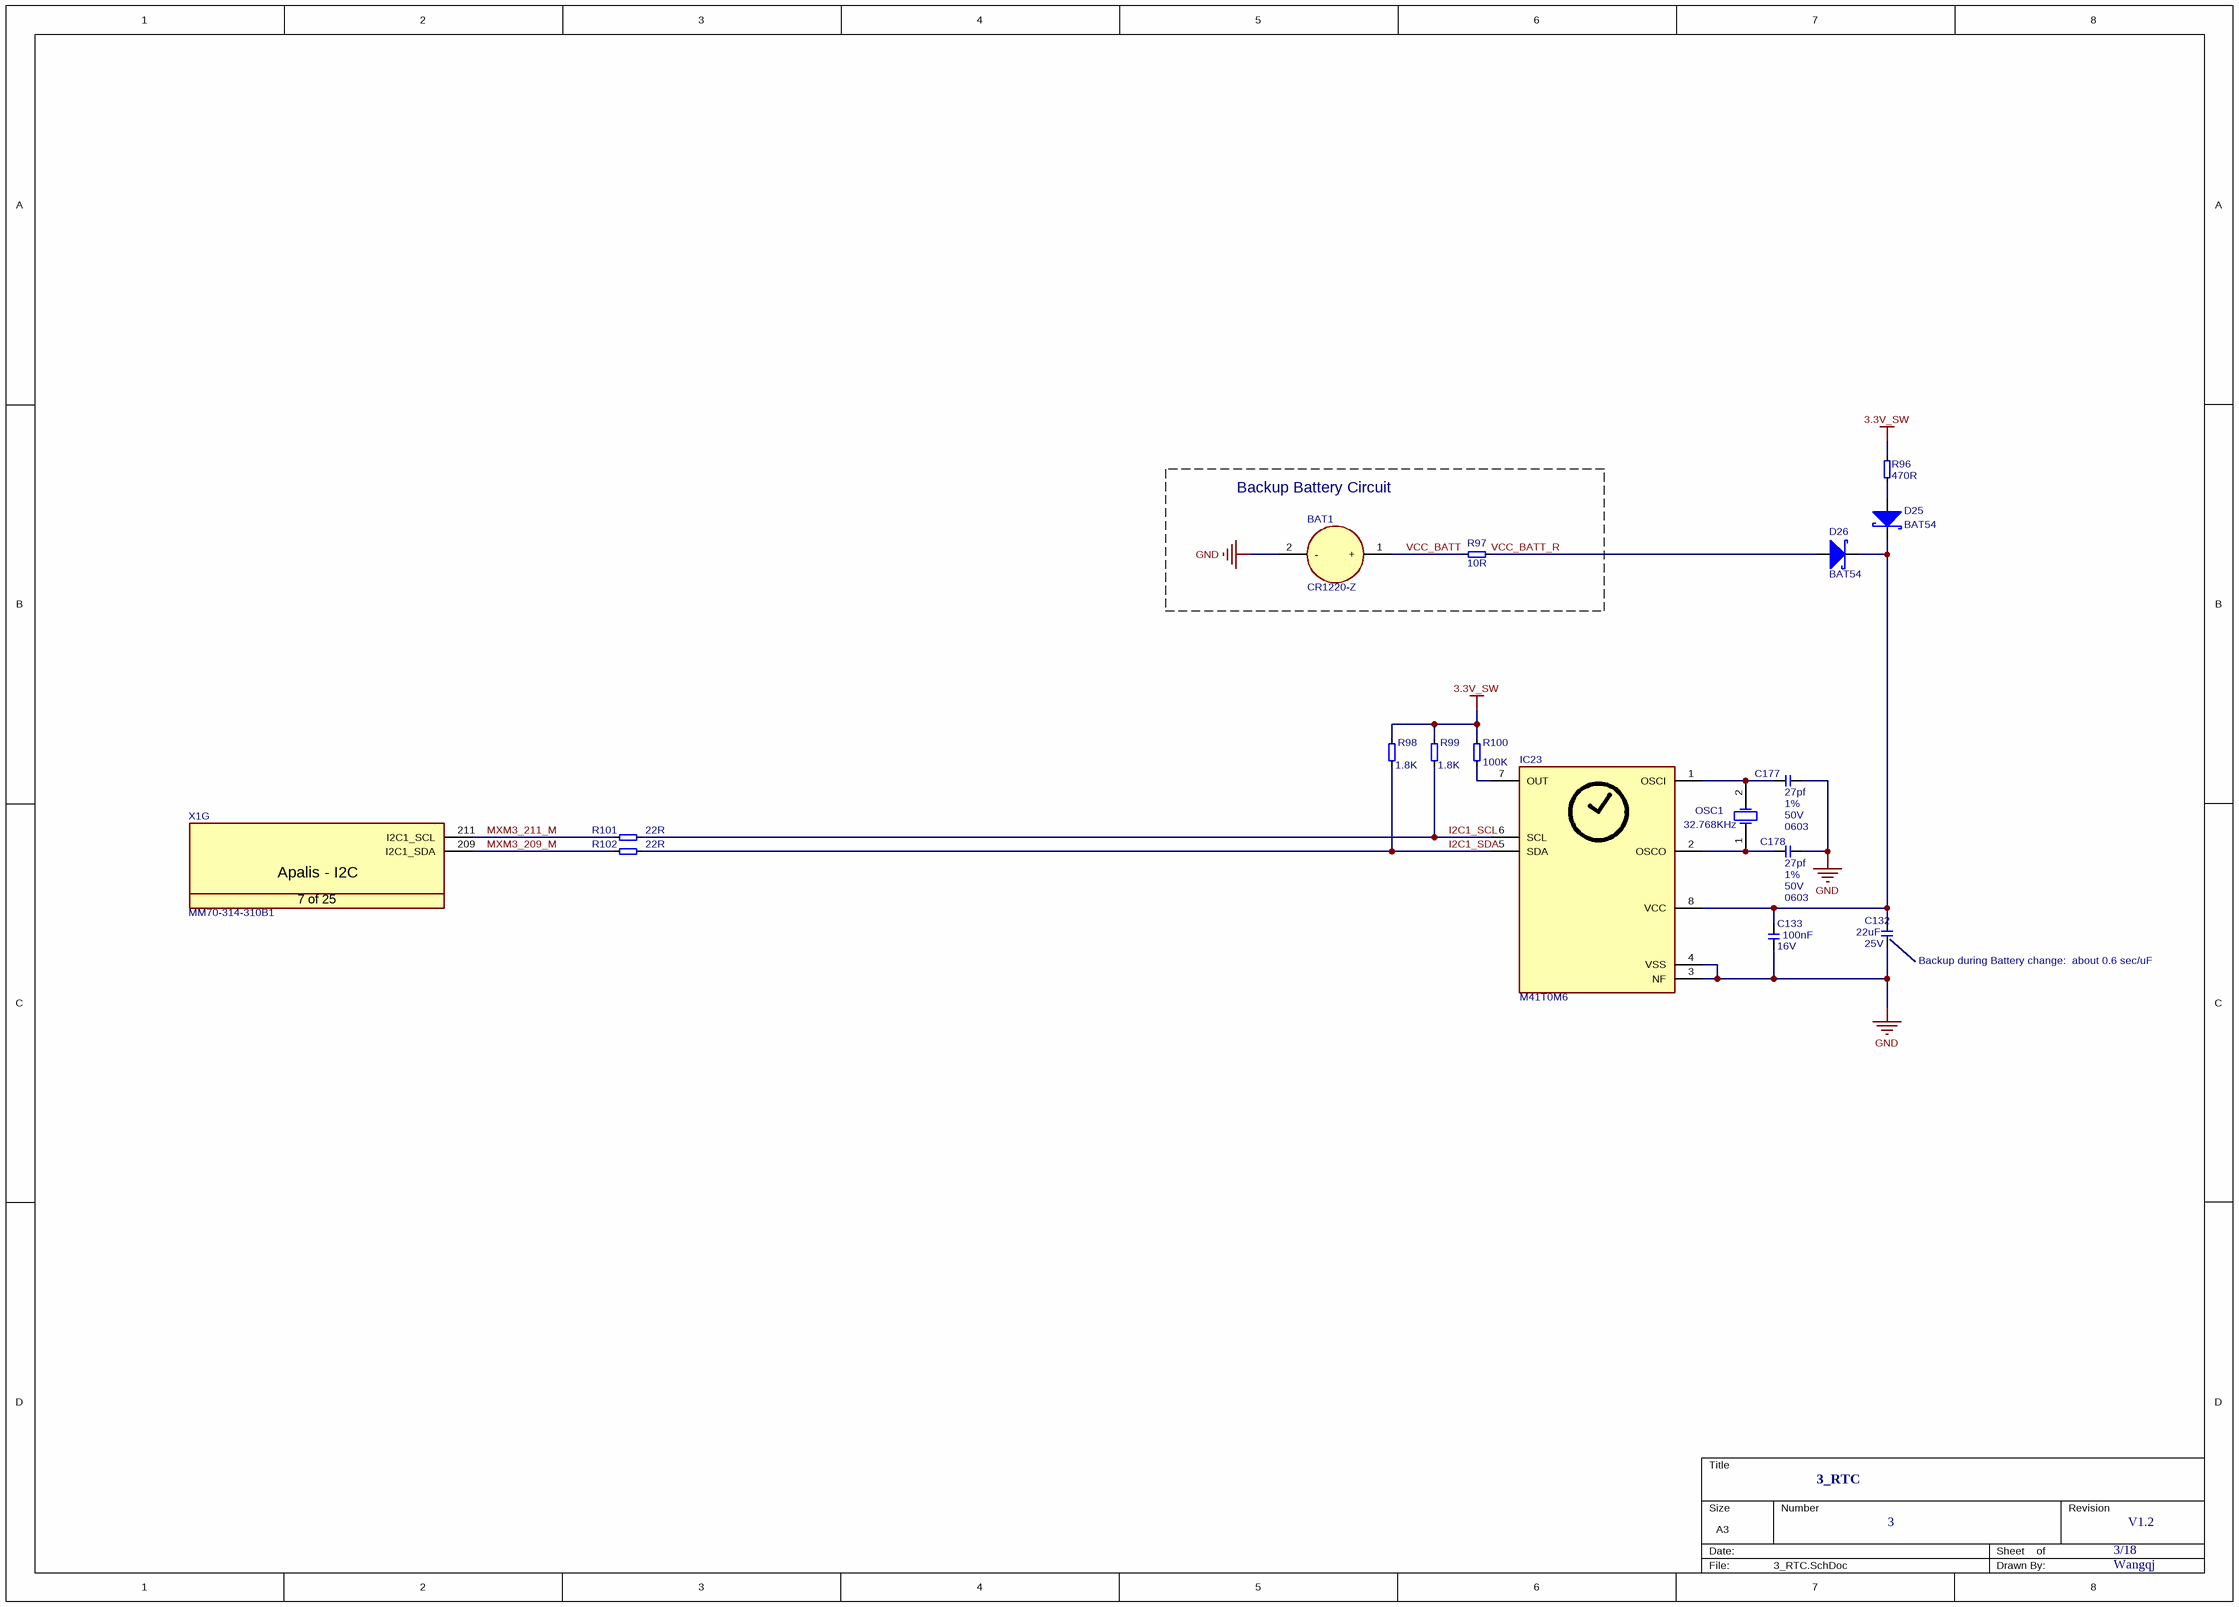
[diagram p2: 3_RTC.SchDoc]

### Parts
BAT1  CR1220-Z  [CR1220-Z]
C132  Rating: 25V  [CAPC3225X160N]  (hidden comment: 22uF)
C133  Rating: 16V  [T_CAPC0603X33N]  (hidden comment: 100nF)
C177  value 27pf  Tolerance: 1%  Rating: 50V  Footprint: 0603  [CAPC0603]  (hidden comment: 27pf-50V-1%-0603)
C178  value 27pf  Tolerance: 1%  Rating: 50V  Footprint: 0603  [CAPC0603]  (hidden comment: 0.1uf-50V-10%-0603)
D25  BAT54  [SOT95P230X110-3N]
D26  BAT54  [SOT95P230X110-3N]
IC23  M41T0M6  [SOIC127P600X173-8N]
OSC1  value 32.768KHz  [SMD-3215-2P]  (hidden comment: CC4V-T1A)
R96  470R  [T_RESC0603X30N]
R97  10R  [t_RESC0603X30N]
R98  1.8K  [T_RESC0603X30N]
R99  1.8K  [T_RESC0603X30N]
R100  100K  [t_RESC0603X30N]
R101  22R  [T_RESC0603X30N]
R102  22R  [T_RESC0603X30N]
X1  Manufacturer Part No.: MM70-314-310B1  [T_JAE_MM70-314-310B1]  (hidden comment: CON-JAE-MM70-314-310B1-314-0.5mm)  (part G of 25)

### Blocks framed on the sheet
Backup Battery Circuit: BAT1 R97

### Nets
3.3V_SW: R96.2 R98.2 R99.2 R100.2
GND: BAT1.2(-) C132.1 C133.1 C177.2 C178.2 IC23.3(NF) IC23.4(VSS)
I2C1_SCL: IC23.6(SCL) R99.1 R101.2
I2C1_SDA: IC23.5(SDA) R98.1 R102.2
MXM3_209_M: R102.1 X1.209(I2C1_SDA)
MXM3_211_M: R101.1 X1.211(I2C1_SCL)
VCC_BATT: BAT1.1(+) R97.1
VCC_BATT_R: D26.1 R97.2
NetC132_2: C132.2 C133.2 D25.3 D26.3 IC23.8(VCC)
NetC177_1: C177.1 IC23.1(OSCI) OSC1.2(OSC2)
NetC178_1: C178.1 IC23.2(OSCO) OSC1.1(OSC1)
NetD25_1: D25.1 R96.1
NetIC23_7: IC23.7(OUT) R100.1

### Notes on the sheet
- (near C132) Backup during Battery change:  about 0.6 sec/uF
- 3_RTC
- 3
- 3/18
- V1.2
- Wangqj
- Title
- Size:
- Date:
- A3
- Number:
- Time:
- Revision:
- Sheet
- of
- File:
- (in symbol CON-JAE-MM70-314-310B1-314-0.5mm, part G) Apalis - I2C; 7 of 25

### Library data of the parts
BAT1 = BAT-Renata-HU2032-LF: CR1220 Battery Holder; Manufacturer Name: Renata; Manufacturer Part No.: CR1220-Z
C132 = C-X5R-22uF-25V-20%-1210: Capacitor Ceramic X5R 22uF 25V 20% 1210; Tolerance: 20%; Type: X5R; Value: 22uF
C133 = C-X7R-100nF-16V-10%-0603: Capacitor Ceramic X7R 100nF 16V 10% 0603; Tolerance: 10%; Type: X7R; Value: 100nF
C177 C178 = C-Ceramic: 33pf-50V-5%-0603; Type: X7R
D25 D26 = D-Philips-BAT54-Schottky: BAT54 Schottky Diode; Manufacturer Name: Philips; Manufacturer Part No.: BAT54
IC23 = IC-ST-M41T0M6: RTC M41T0M6; Manufacturer Name: ST; Manufacturer Part No.: M41T0M6
OSC1 = OSC-MC-CC4V-T1A-32.768KHz-30ppm-5x1.9mm: Quartz 32.768kHz; Manufacturer Name: Micro Crystal; Tolerance: 30ppm; Manufacturer Part No.: CC4V-T1A
R96 = R-470R-63mW-5%-0603: Resistor 470 ohm 63mW 5% 0603; Rating: 63mW; Tolerance: 5%; Value: 470R
R97 = R-10R-63mW-5%-0603: Resistor 10 ohm 63mW 5% 0603; Rating: 63mW; Tolerance: 5%; Value: 10R
R98 R99 = R-1.8KR-63mW-5%-0603: Resistor 1.8 Kohm 63mW 5% 0603; Value: 1.8KR; Rating: 63mW; Tolerance: 5%
R100 = R-100KR-63mW-5%-0603: as R35 on sheet 2_Power_Switch; Rating: 63mW; Tolerance: 5%
R101 R102 = R-22R-63mW-5%-0402: Resistor 22 ohm 63mW 5% 0603; Rating: 63mW; Tolerance: 5%; Value: 22R
X1 = CON-JAE-MM70-314-310B1-314-0.5mm: as X1 on sheet 1_Power_Supply

## Sheet 4_SDCard.SchDoc: Apalis Evaluation Board 1.1
size A3; Organization: Toradex AG; Address1: Altsagenstrasse 5; Address2: Horw; Address3: 6048; Address4: Switzerland; DocumentNumber: 8; Revision: V1.1; SheetNumber: 8; SheetTotal: 32; PageSetup: Record=PageOptions|CenterHorizontal=True|CenterVertical=True|PrintScale=0.73|XCorrection=1.00|YCorrection=1.00|PrintKind=0|BorderSize=5000000|LeftOffset=0|BottomOffset=0|Orientation=2|PaperLength=1000|PaperWidth=1000|Scale=100|PaperSource=7|PrintQuality=-4|MediaType=1|DitherType=10|PaperKind=A4|PrintScaleMode=1
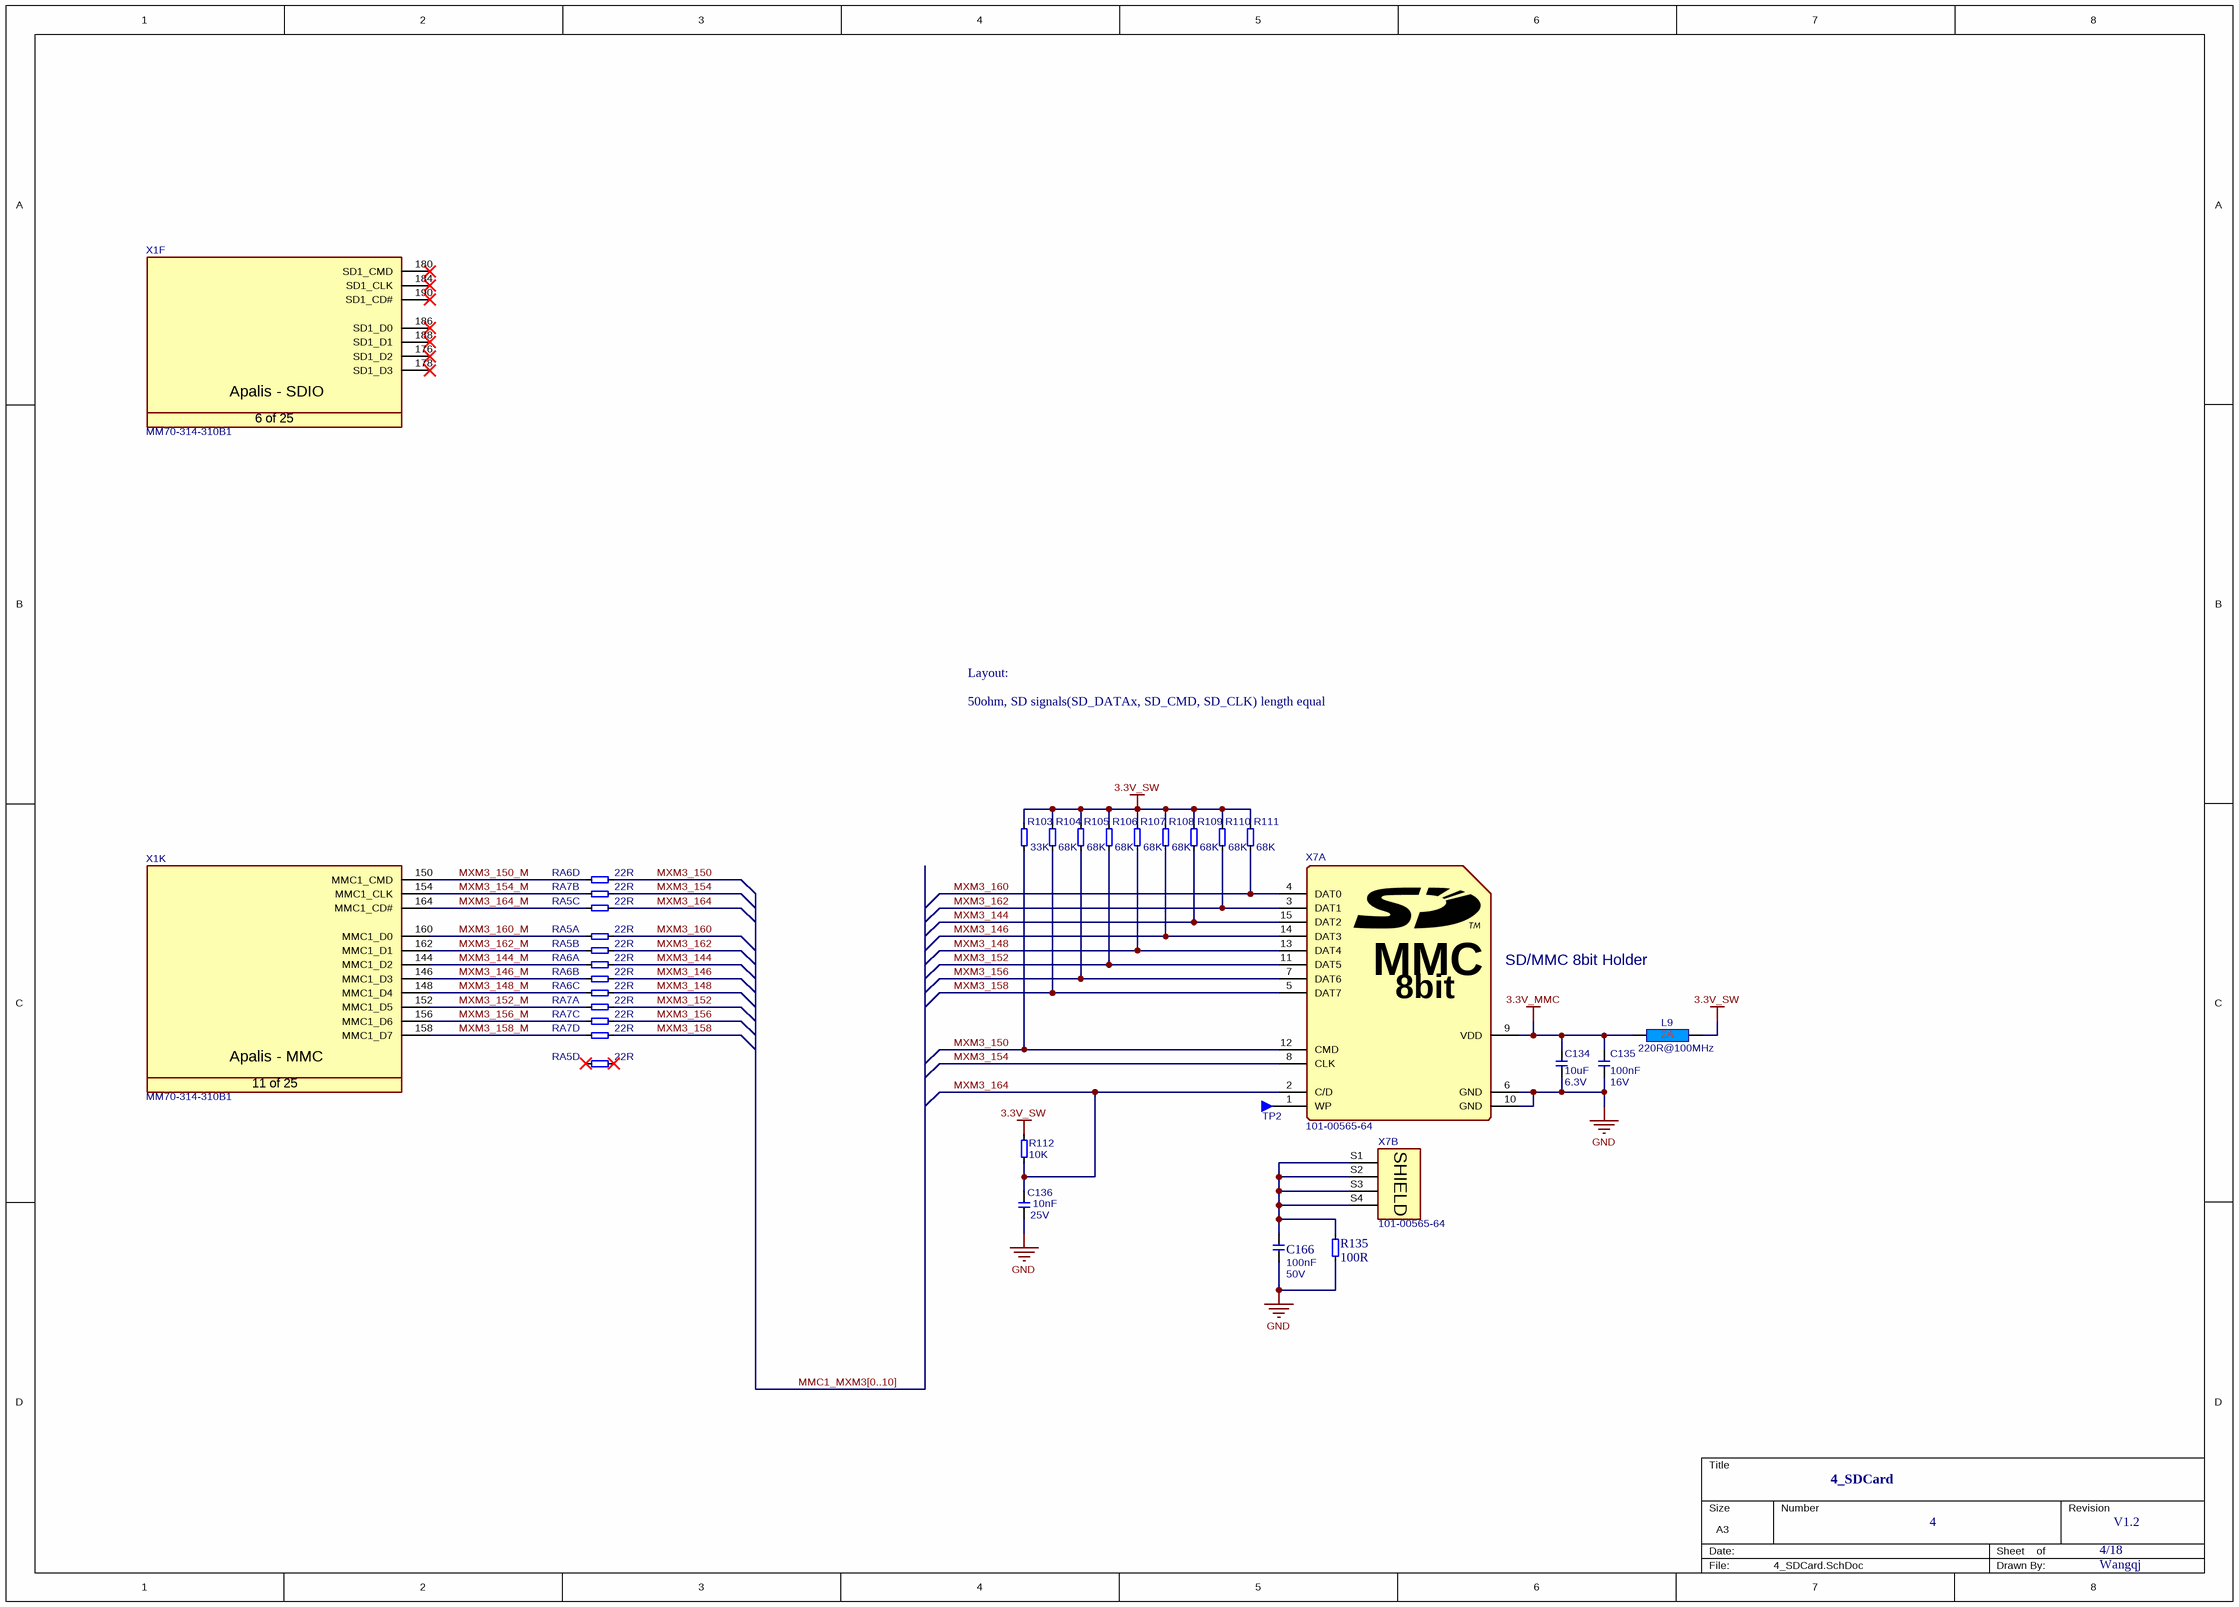
[diagram p3: 4_SDCard.SchDoc]

### Parts
C134  Rating: 6.3V  [T_CAPC0603X33N]  (hidden comment: 10uF)
C135  Rating: 16V  [T_CAPC0603X33N]  (hidden comment: 100nF)
C136  Rating: 25V  [T_CAPC0603X33N]  (hidden comment: 10nF)
C166  Rating: 50V  [T_CAPC0603X33N]  (hidden comment: 100nF)
L9  220R@100MHz  [INDC1608X95N]
R103  33K  [T_RESC0603X30N]
R104  68K  [T_RESC0603X30N]
R105  68K  [T_RESC0603X30N]
R106  68K  [T_RESC0603X30N]
R107  68K  [T_RESC0603X30N]
R108  68K  [T_RESC0603X30N]
R109  68K  [T_RESC0603X30N]
R110  68K  [T_RESC0603X30N]
R111  68K  [T_RESC0603X30N]
R112  10K  [T_RESC0603X30N]
R135  100R  [T_RESC0603X30N]
RA5  22R  [T_Resistor_Array_X4]  (parts A,B,C,D of 4)
RA6  22R  [T_Resistor_Array_X4]  (parts A,B,C,D of 4)
RA7  22R  [T_Resistor_Array_X4]  (parts A,B,C,D of 4)
TP2  Testpin  [T_TP-THT]  (value not drawn)
X1  Manufacturer Part No.: MM70-314-310B1  [T_JAE_MM70-314-310B1]  (hidden comment: CON-JAE-MM70-314-310B1-314-0.5mm)  (parts F,K of 25)
X7  101-00565-64  [T_ AMPHENOL_101-00565]  (parts A,B of 2)

### Nets
3.3V_MMC: C134.2 C135.2 L9.1 X7.9(VDD)
3.3V_SW: L9.2 R103.2 R104.2 R105.2 R106.2 R107.2 R108.2 R109.2 R110.2 R111.2 R112.2
GND: C134.1 C135.1 C136.1 C166.1 R135.1 X7.6(GND) X7.10(GND)
MXM3_144: R109.1 RA6.5 X7.15(DAT2)
MXM3_144_M: RA6.1 X1.144(MMC1_D2)
MXM3_146: R108.1 RA6.6 X7.14(DAT3)
MXM3_146_M: RA6.2 X1.146(MMC1_D3)
MXM3_148: R107.1 RA6.7 X7.13(DAT4)
MXM3_148_M: RA6.3 X1.148(MMC1_D4)
MXM3_150: R103.1 RA6.8 X7.12(CMD)
MXM3_150_M: RA6.4 X1.150(MMC1_CMD)
MXM3_152: R106.1 RA7.5 X7.11(DAT5)
MXM3_152_M: RA7.1 X1.152(MMC1_D5)
MXM3_154: RA7.6 X7.8(CLK)
MXM3_154_M: RA7.2 X1.154(MMC1_CLK)
MXM3_156: R105.1 RA7.7 X7.7(DAT6)
MXM3_156_M: RA7.3 X1.156(MMC1_D6)
MXM3_158: R104.1 RA7.8 X7.5(DAT7)
MXM3_158_M: RA7.4 X1.158(MMC1_D7)
MXM3_160: R111.1 RA5.5 X7.4(DAT0)
MXM3_160_M: RA5.1 X1.160(MMC1_D0)
MXM3_162: R110.1 RA5.6 X7.3(DAT1)
MXM3_162_M: RA5.2 X1.162(MMC1_D1)
MXM3_164: C136.2 R112.1 RA5.7 X7.2(C/D)
MXM3_164_M: RA5.3 X1.164(MMC1_CD#)
NetC166_2: C166.2 R135.2 X7.S1(S) X7.S2(S) X7.S3(S) X7.S4(S)
NetTP2_1: TP2.1 X7.1(WP)

Not connected (* = marked no-connect by the designer): RA5 4* 8*; X1 176(SD1_D2)* 178(SD1_D3)* 180(SD1_CMD)* 184(SD1_CLK)* 186(SD1_D0)* 188(SD1_D1)* 190(SD1_CD#)*

### Buses and harness runs
bus MMC1_MXM3[0..10]

### Notes on the sheet
- Layout:
- 50ohm, SD signals(SD_DATAx, SD_CMD, SD_CLK) length equal
- (near X7) SD/MMC 8bit Holder
- 4_SDCard
- 4
- 4/18
- V1.2
- Wangqj
- Title
- Size:
- Date:
- A3
- Number:
- Time:
- Revision:
- Sheet
- of
- File:
- (in symbol CON-Amphenol-101-00565-64, part A) MMC; 8bit
- (in symbol CON-Amphenol-101-00565-64, part B) SHIELD
- (in symbol CON-JAE-MM70-314-310B1-314-0.5mm, part F) Apalis - SDIO; 6 of 25
- (in symbol CON-JAE-MM70-314-310B1-314-0.5mm, part K) Apalis - MMC; 11 of 25

### Library data of the parts
C134 = C-X5R-10uF-6.3V-20%-0603: Capacitor Ceramic X5R 10uF 6.3V 20% 0603; Tolerance: 20%; Type: X5R; Value: 10uF
C135 = C-X7R-100nF-16V-10%-0603: Capacitor Ceramic X7R 100nF 16V 10% 0603; Tolerance: 10%; Type: X7R; Value: 100nF
C136 = C-X7R-10nF-25V-10%-0603: Capacitor Ceramic X7R 10nF 25V 10% 0603; Tolerance: 10%; Type: X7R; Value: 10nF
C166 = C-100nF-50V-20%-0603-X7R: Capacitor Ceramic X7R 100nF 50V 20% 0603; Tolerance: 20%; Type: X7R; Value: 100nF
L9 = L-220R@100MHz-2A-25%-0603: as L18 on sheet 1_Power_Supply; Rating: 2A; Value: 220R@100MHz
R103 = R-33KR-63mW-5%-0603: Resistor 33 Kohm 63mW 5% 0603; Value: 33KR; Rating: 63mW; Tolerance: 5%
R104-R111 = R-68KR-63mW-5%-0603: Resistor 68 Kohm 63mW 5% 0603; Value: 68KR; Rating: 63mW; Tolerance: 5%
R112 = R-10KR-63mW-5%-0603: as R84 on sheet 2_Power_Switch; Rating: 63mW; Tolerance: 5%
R135 = R-120R-63mW-5%-0603: Resistor 120 ohm 63mW 5% 0603; Rating: 63mW; Tolerance: 5%; Value: 100R
RA5-RA7 = RA-22R-63mW-5%-1206-div: Resistor Array 22 R 63mW 5% 1206; Tolerance: 5%; Power Dissipation: 63mW; Value: 22R
TP2 = Testpin: Testpin TH
X1 = CON-JAE-MM70-314-310B1-314-0.5mm: as X1 on sheet 1_Power_Supply
X7 = CON-Amphenol-101-00565-64: SD/MMC 8bit Card Holder; No. of ways: 13+2; Manufacturer Name: Amphenol; Manufacturer Part No.: 101-00565-64

## Sheet 5_Ethernet.SchDoc: Apalis Evaluation Board 1.1
size A3; Organization: Toradex AG; Address1: Altsagenstrasse 5; Address2: Horw; Address3: 6048; Address4: Switzerland; DocumentNumber: 9; Revision: V1.1; SheetNumber: 9; SheetTotal: 32; PageSetup: Record=PageOptions|CenterHorizontal=True|CenterVertical=True|PrintScale=0.73|XCorrection=1.00|YCorrection=1.00|PrintKind=0|BorderSize=5000000|LeftOffset=0|BottomOffset=0|Orientation=2|PaperLength=1000|PaperWidth=1000|Scale=100|PaperSource=7|PrintQuality=-4|MediaType=1|DitherType=10|PaperKind=A4|PrintScaleMode=1
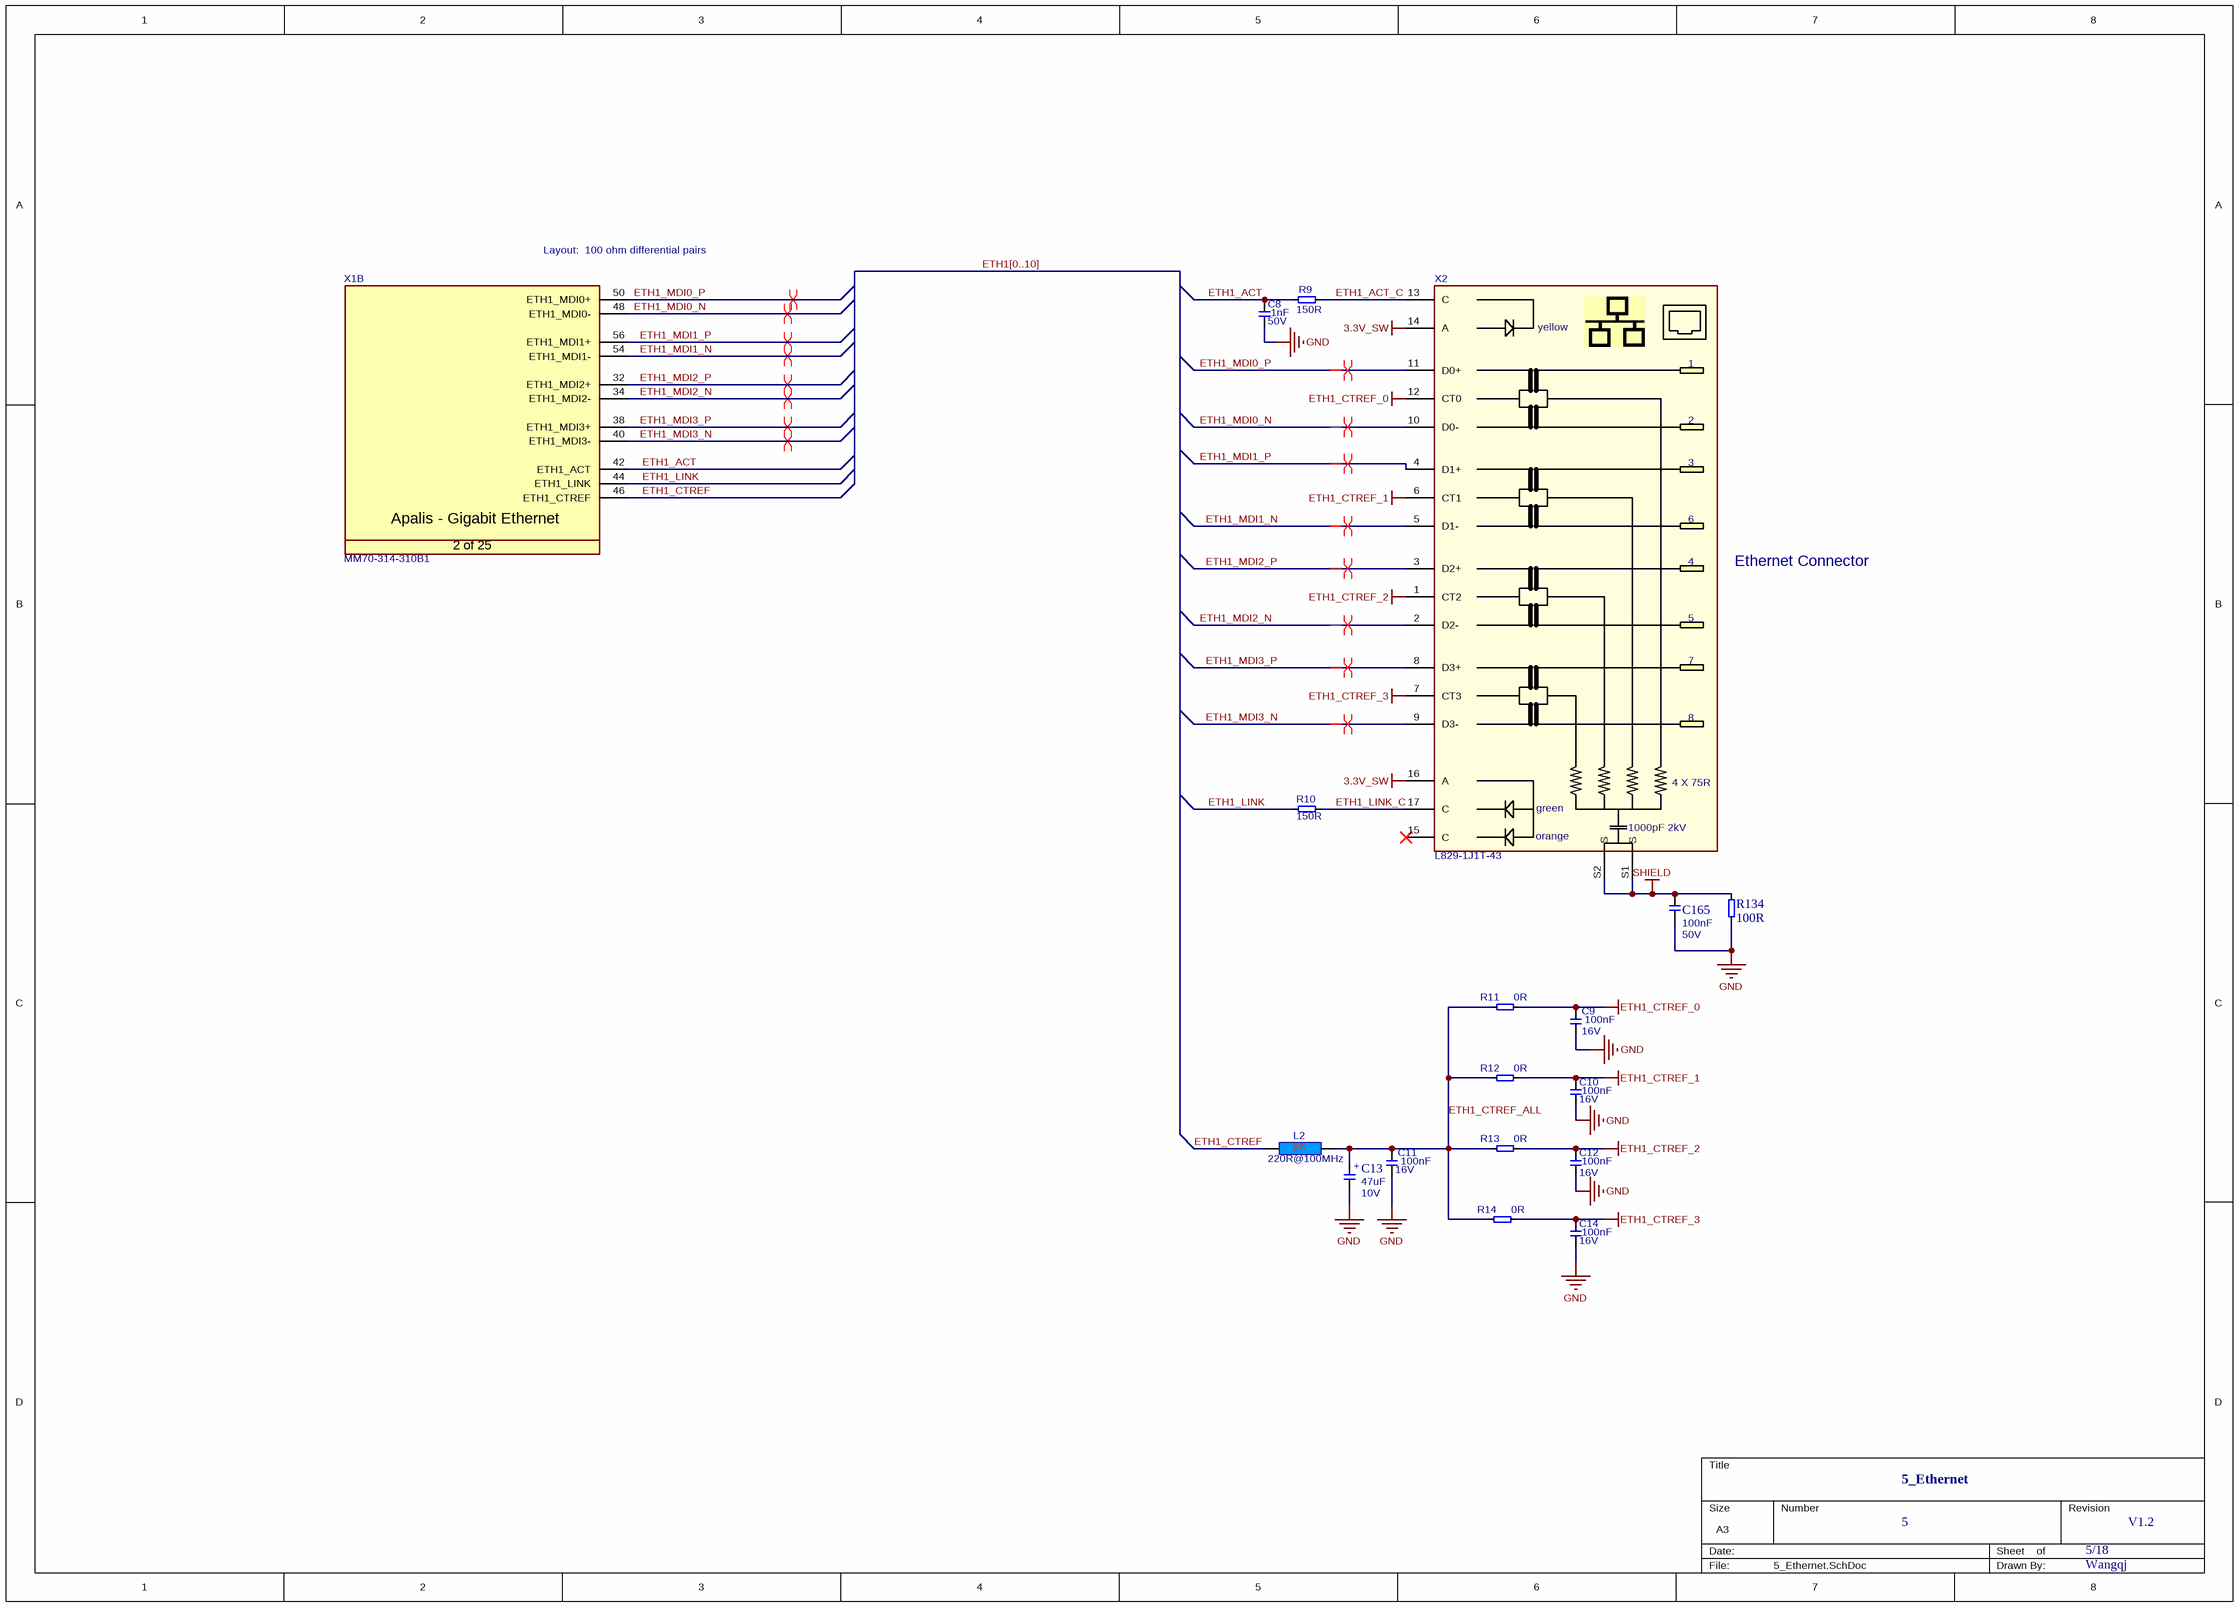
[diagram p4: 5_Ethernet.SchDoc]

### Parts
C8  Rating: 50V  [CAPC1005X60N]  (hidden comment: 1nF)
C9  Rating: 16V  [T_CAPC0603X33N]  (hidden comment: 100nF)
C10  Rating: 16V  [T_CAPC0603X33N]  (hidden comment: 100nF)
C11  Rating: 16V  [T_CAPC0603X33N]  (hidden comment: 100nF)
C12  Rating: 16V  [T_CAPC0603X33N]  (hidden comment: 100nF)
C13  Rating: 10V  [T_CAPMP3216X180N]  (hidden comment: 47uF)
C14  Rating: 16V  [T_CAPC0603X33N]  (hidden comment: 100nF)
C165  Rating: 50V  [T_CAPC0603X33N]  (hidden comment: 100nF)
L2  220R@100MHz  [INDC1608X95N]
R9  150R  [t_RESC0603X30N]
R10  150R  [t_RESC0603X30N]
R11  0R  [T_RESC0603X30N]
R12  0R  [T_RESC0603X30N]
R13  0R  [T_RESC0603X30N]
R14  0R  [T_RESC0603X30N]
R134  100R  [T_RESC0603X30N]
X1  Manufacturer Part No.: MM70-314-310B1  [T_JAE_MM70-314-310B1]  (hidden comment: CON-JAE-MM70-314-310B1-314-0.5mm)  (part B of 25)
X2  L829-1J1T-43  [T_BEL_L829-1J1T-43]

### Nets
3.3V_SW: X2.14(A) X2.16(A)
ETH1_CTREF_0: C9.2 R11.2 X2.12(CT0)
ETH1_CTREF_1: C10.2 R12.2 X2.6(CT1)
ETH1_CTREF_2: C12.2 R13.2 X2.1(CT2)
ETH1_CTREF_3: C14.2 R14.2 X2.7(CT3)
GND: C8.1 C9.1 C10.1 C11.1 C12.1 C13.2 C14.1 C165.1 R134.1
SHIELD: C165.2 R134.2 X2.S1(S) X2.S2(S)
ETH1_ACT: C8.2 R9.1 X1.42(ETH1_ACT)
ETH1_ACT_C: R9.2 X2.13(C)
ETH1_CTREF: L2.1 X1.46(ETH1_CTREF)
ETH1_CTREF_ALL: C11.2 C13.1 L2.2 R11.1 R12.1 R13.1 R14.1
ETH1_LINK: R10.1 X1.44(ETH1_LINK)
ETH1_LINK_C: R10.2 X2.17(C)
ETH1_MDI0_N: X1.48(ETH1_MDI0-) X2.10(D0-)
ETH1_MDI0_P: X1.50(ETH1_MDI0+) X2.11(D0+)
ETH1_MDI1_N: X1.54(ETH1_MDI1-) X2.5(D1-)
ETH1_MDI1_P: X1.56(ETH1_MDI1+) X2.4(D1+)
ETH1_MDI2_N: X1.34(ETH1_MDI2-) X2.2(D2-)
ETH1_MDI2_P: X1.32(ETH1_MDI2+) X2.3(D2+)
ETH1_MDI3_N: X1.40(ETH1_MDI3-) X2.9(D3-)
ETH1_MDI3_P: X1.38(ETH1_MDI3+) X2.8(D3+)

Not connected (* = marked no-connect by the designer): X2 15(C)*

### Buses and harness runs
bus ETH1[0..10]

### Layout directives
differential pair: ETH1_MDI0_N, ETH1_MDI0_P, ETH1_MDI1_N, ETH1_MDI1_P, ETH1_MDI2_N, ETH1_MDI2_P, ETH1_MDI3_N, ETH1_MDI3_P

### Notes on the sheet
- (near X1) Layout:  100 ohm differential pairs
- Ethernet Connector
- 5_Ethernet
- 5
- 5/18
- V1.2
- Wangqj
- Title
- Size:
- Date:
- A3
- Number:
- Time:
- Revision:
- Sheet
- of
- File:
- (in symbol C-47uF-10V-10%-3216-TA) +
- (in symbol CON-BEL-L829-1J1T-43) yellow; 4 X 75R; green; 1000pF 2kV; orange
- (in symbol CON-JAE-MM70-314-310B1-314-0.5mm, part B) Apalis - Gigabit Ethernet; 2 of 25

### Library data of the parts
C8 = C-X7R-1nF-50V-10%-0402: Capacitor Ceramic X7R 1nF 50V 10% 0402; Tolerance: 10%; Type: X7R; Value: 1nF
C9-C12 C14 = C-X7R-100nF-16V-10%-0603: Capacitor Ceramic X7R 100nF 16V 10% 0603; Tolerance: 10%; Type: X7R; Value: 100nF
C13 = C-47uF-10V-10%-3216-TA: Capacitor TA 47uF 10V 10% 3216; Tolerance: 10%; Type: TA; Value: 47uF
C165 = C-100nF-50V-20%-0603-X7R: Capacitor Ceramic X7R 100nF 50V 20% 0603; Tolerance: 20%; Type: X7R; Value: 100nF
L2 = L-220R@100MHz-2A-25%-0603: as L18 on sheet 1_Power_Supply; Rating: 2A; Value: 220R@100MHz
R9 R10 = R-150R-63mW-1%-0603: Resistor 150 ohm 63mW 1% 0603; Tolerance: 1%; Value: 150R; Rating: 63mW
R11-R14 = R-0R-63mW-1%-0603: Resistor 0 ohm 63mW 1% 0603; Rating: 63mW; Tolerance: 1%; Value: 0R
R134 = R-120R-63mW-5%-0603: Resistor 120 ohm 63mW 5% 0603; Rating: 63mW; Tolerance: 5%; Value: 100R
X1 = CON-JAE-MM70-314-310B1-314-0.5mm: as X1 on sheet 1_Power_Supply
X2 = CON-BEL-L829-1J1T-43: Low profile 10/100/1G Mag Jack; Manufacturer Name: BEL; Manufacturer Part No.: L829-1J1T-43

## Sheet 6_CAN.SchDoc: Apalis Evaluation Board 1.1
size A3; Organization: Toradex AG; Address1: Altsagenstrasse 5; Address2: Horw; Address3: 6048; Address4: Switzerland; DocumentNumber: 19; Revision: V1.1; SheetNumber: 5; SheetTotal: 19; PageSetup: Record=PageOptions|CenterHorizontal=True|CenterVertical=True|PrintScale=0.73|XCorrection=1.00|YCorrection=1.00|PrintKind=0|BorderSize=5000000|LeftOffset=0|BottomOffset=0|Orientation=2|PaperLength=1000|PaperWidth=1000|Scale=100|PaperSource=7|PrintQuality=-4|MediaType=1|DitherType=10|PaperKind=A4|PrintScaleMode=1
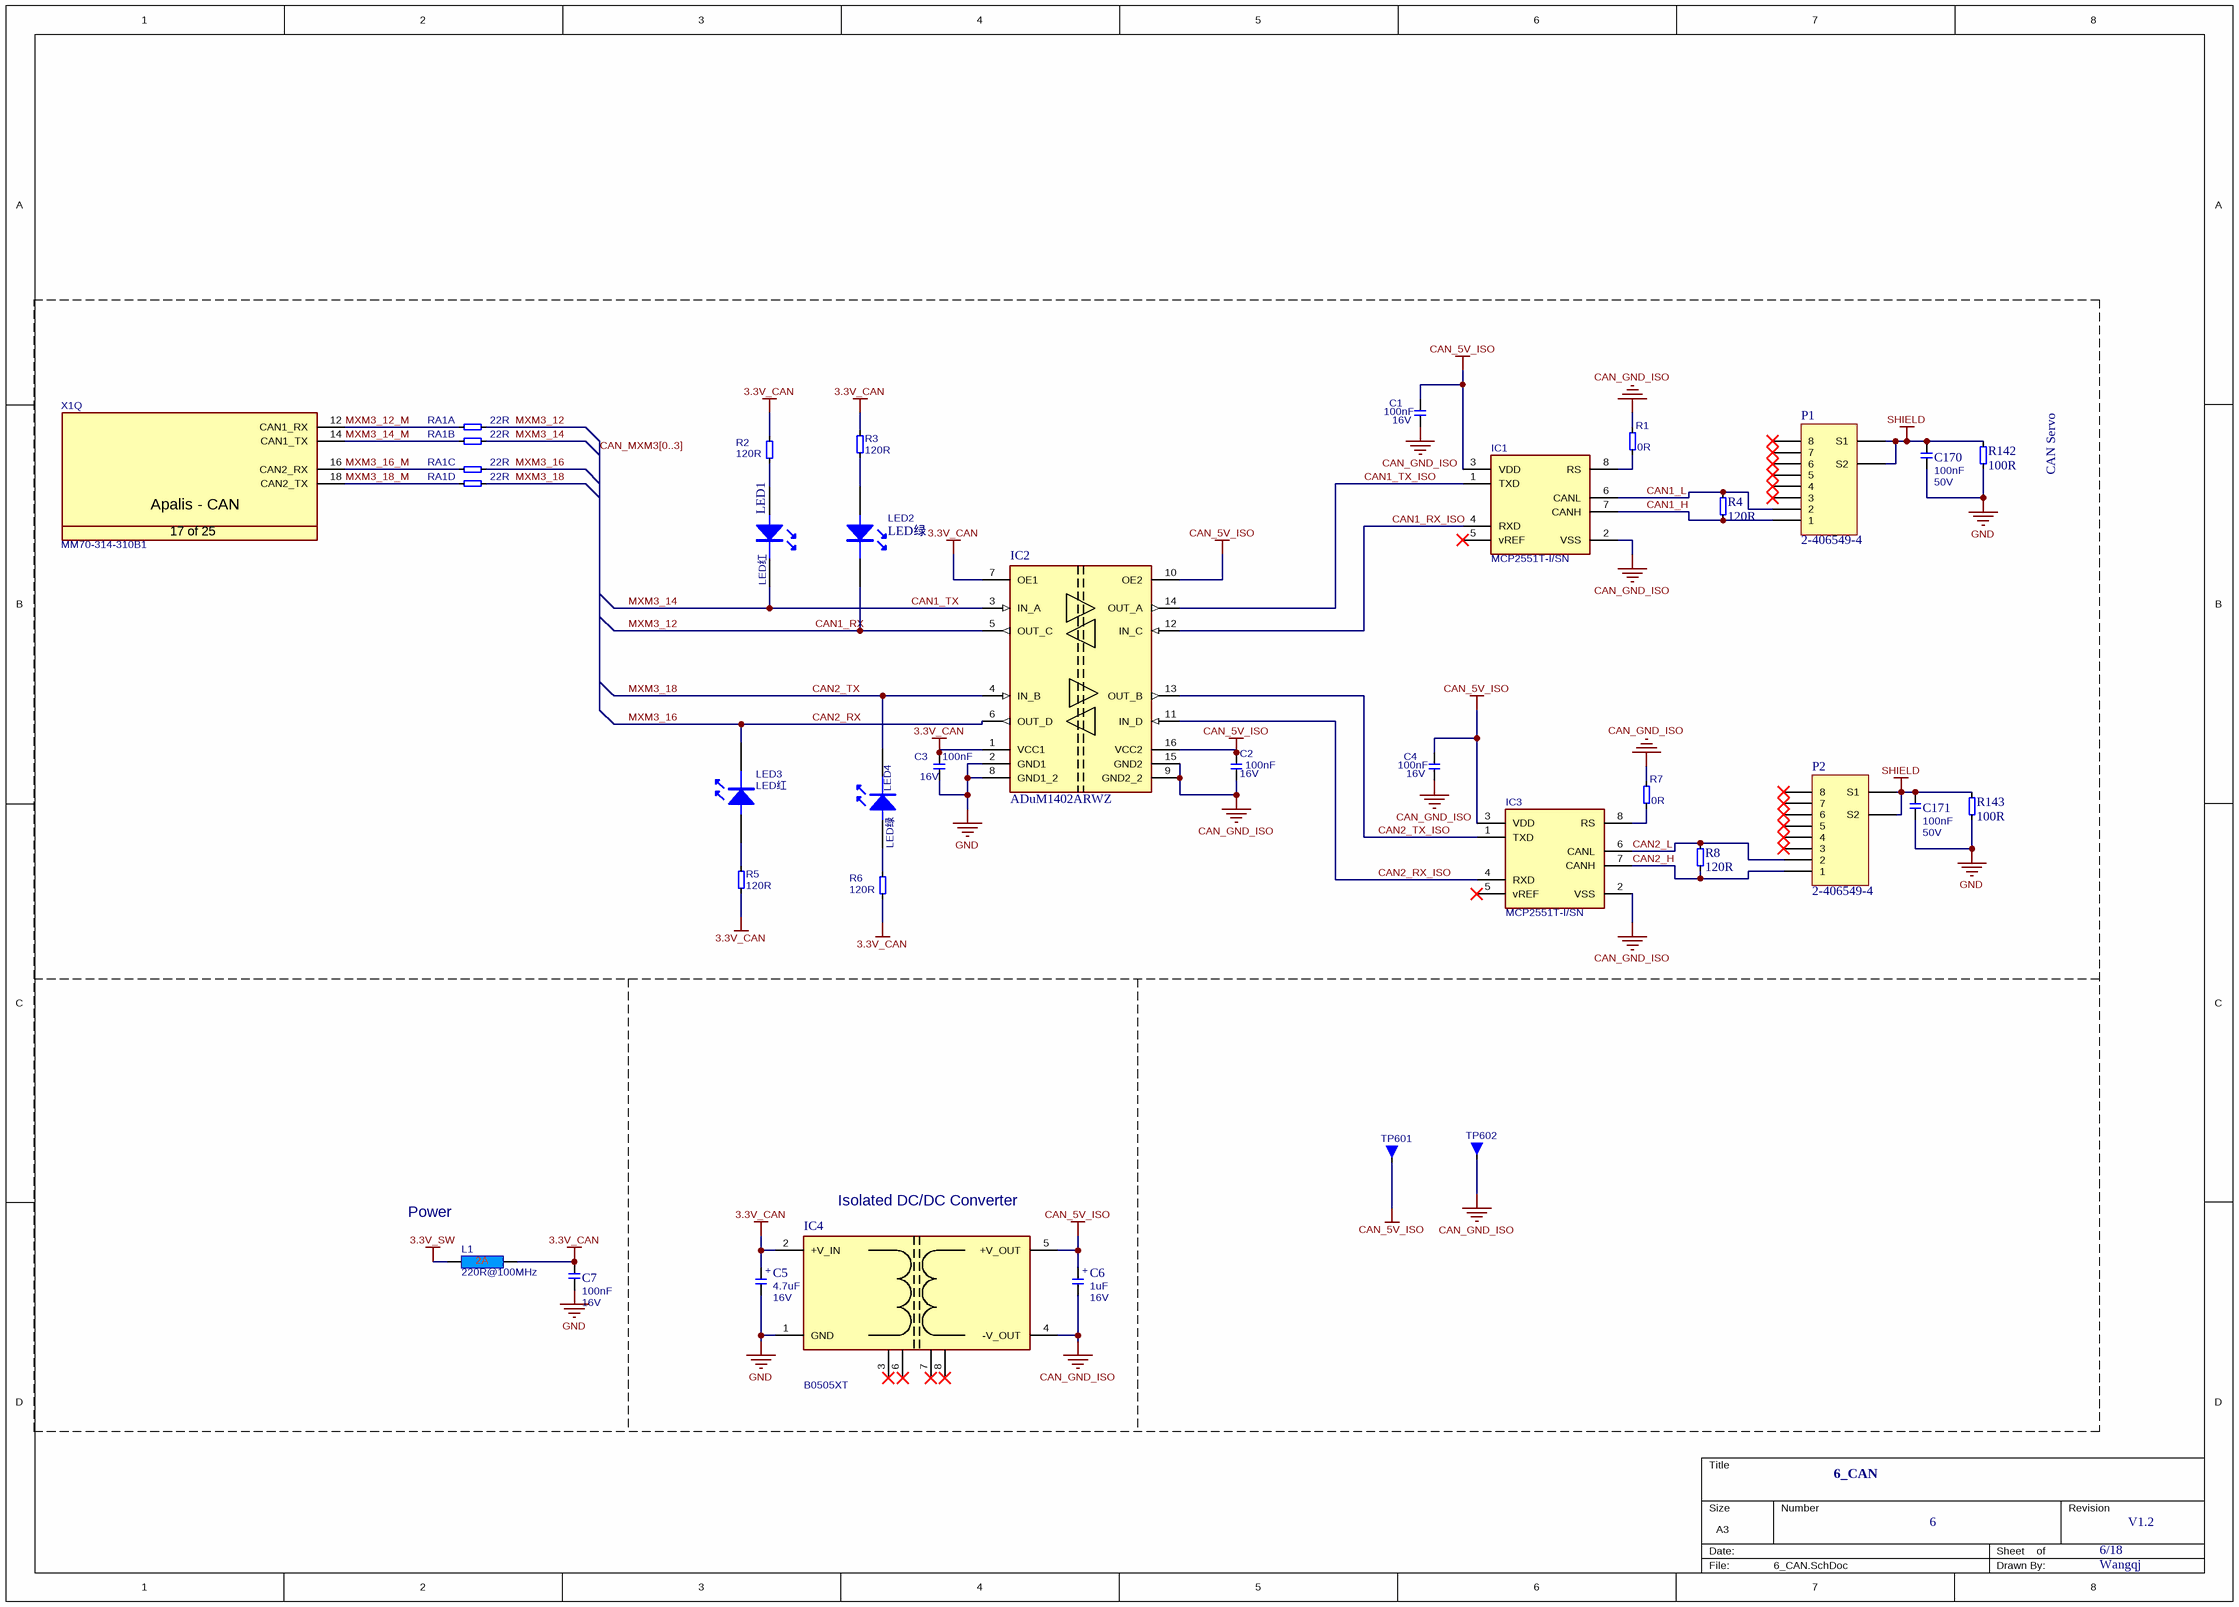
[diagram p5: 6_CAN.SchDoc]

### Parts
C1  Rating: 16V  [T_CAPC0603X33N]  (hidden comment: 100nF)
C2  Rating: 16V  [T_CAPC0603X33N]  (hidden comment: 100nF)
C3  Rating: 16V  [T_CAPC0603X33N]  (hidden comment: 100nF)
C4  Rating: 16V  [T_CAPC0603X33N]  (hidden comment: 100nF)
C5  Rating: 16V  [T_CAPMP3216X180N]  (hidden comment: 4.7uF)
C6  Rating: 16V  [T_CAPMP3216X180N]  (hidden comment: 1uF)
C7  Rating: 16V  [T_CAPC0603X33N]  (hidden comment: 100nF)
C170  Rating: 50V  [T_CAPC0603X33N]  (hidden comment: 100nF)
C171  Rating: 50V  [T_CAPC0603X33N]  (hidden comment: 100nF)
IC1  MCP2551T-I/SN  [SOIC127P600X173-8N]
IC2  ADuM1402ARWZ  [T_AD_ADuM1300ARW]
IC3  MCP2551T-I/SN  [SOIC127P600X173-8N]
IC4  Manufacturer Part No.: B0505XT  [MORNSUN_B0305XT-1W_SMD]  (hidden comment: B0505XT-1W)
L1  220R@100MHz  [INDC1608X95N]
LED1  LED红  [LC-0805_LED_S3]
LED2  LED绿  [LC-0805_LED_S3]
LED3  LED红  [LC-0805_LED_S3]
LED4  LED绿  [LC-0805_LED_S3]
P1  2-406549-4  [RJ45卡口朝上]
P2  2-406549-4  [RJ45卡口朝上]
R1  0R  [T_RESC0603X30N]
R2  120R  [T_RESC0603X30N]
R3  120R  [T_RESC0603X30N]
R4  120R  [T_RESC0603X30N]
R5  120R  [T_RESC0603X30N]
R6  120R  [T_RESC0603X30N]
R7  0R  [T_RESC0603X30N]
R8  120R  [T_RESC0603X30N]
R142  100R  [T_RESC0603X30N]
R143  100R  [T_RESC0603X30N]
RA1  22R  [T_Resistor_Array_X4]  (parts A,B,C,D of 4)
TP601  Testpin  [T_TP-THT]  (value not drawn)
TP602  Testpin  [T_TP-THT]  (value not drawn)
X1  Manufacturer Part No.: MM70-314-310B1  [T_JAE_MM70-314-310B1]  (hidden comment: CON-JAE-MM70-314-310B1-314-0.5mm)  (part Q of 25)

### Nets
3.3V_CAN: C3.2 C5.1 C7.2 IC2.1(VCC1) IC2.7(OE1) IC4.2(+V_IN) L1.2 R2.2 R3.2 R5.1 R6.1
3.3V_SW: L1.1
CAN_5V_ISO: C1.2 C2.2 C4.2 C6.1 IC1.3(VDD) IC2.10(OE2) IC2.16(VCC2) IC3.3(VDD) IC4.5(+V_OUT) TP601.1
CAN_GND_ISO: C1.1 C2.1 C4.1 C6.2 IC1.2(VSS) IC2.9(GND2_2) IC2.15(GND2) IC3.2(VSS) IC4.4(-V_OUT) R1.2 R7.2 TP602.1
GND: C3.1 C5.2 C7.1 C170.1 C171.1 IC2.2(GND1) IC2.8(GND1_2) IC4.1(GND) R142.1 R143.1
SHIELD: C170.2 C171.2 P1.S1 P1.S2 P2.S1 P2.S2 R142.2 R143.2
CAN1_H: IC1.7(CANH) P1.1 R4.1
CAN1_L: IC1.6(CANL) P1.2 R4.2
CAN1_RX: IC2.5(OUT_C) LED2.K RA1.5  [also labelled MXM3_12]
CAN1_RX_ISO: IC1.4(RXD) IC2.12(IN_C)
CAN1_TX: IC2.3(IN_A) LED1.K RA1.6  [also labelled MXM3_14]
CAN1_TX_ISO: IC1.1(TXD) IC2.14(OUT_A)
CAN2_H: IC3.7(CANH) P2.1 R8.1
CAN2_L: IC3.6(CANL) P2.2 R8.2
CAN2_RX: IC2.6(OUT_D) LED3.K RA1.7  [also labelled MXM3_16]
CAN2_RX_ISO: IC2.11(IN_D) IC3.4(RXD)
CAN2_TX: IC2.4(IN_B) LED4.K RA1.8  [also labelled MXM3_18]
CAN2_TX_ISO: IC2.13(OUT_B) IC3.1(TXD)
MXM3_12_M: RA1.1 X1.12(CAN1_RX)
MXM3_14_M: RA1.2 X1.14(CAN1_TX)
MXM3_16_M: RA1.3 X1.16(CAN2_RX)
MXM3_18_M: RA1.4 X1.18(CAN2_TX)
NetIC1_8: IC1.8(RS) R1.1
NetIC3_8: IC3.8(RS) R7.1
NetLED1_A: LED1.A R2.1
NetLED2_A: LED2.A R3.1
NetLED3_A: LED3.A R5.2
NetLED4_A: LED4.A R6.2

Not connected (* = marked no-connect by the designer): IC1 5(vREF)*; IC3 5(vREF)*; IC4 3(NC)* 6(NC)* 7(NC)* 8(NC)*; P1 3* 4* 5* 6* 7* 8*; P2 3* 4* 5* 6* 7* 8*

### Buses and harness runs
bus CAN_MXM3[0..3]

### Notes on the sheet
- CAN Servo
- (near L1) Power
- (near IC4) Isolated DC/DC Converter
- 6_CAN
- 6
- 6/18
- V1.2
- Wangqj
- (in symbol C-1uF-16V-10%-3216-TA) +
- (in symbol C-4.7uF-16V-10%-3216-TA) +
- (in symbol CON-JAE-MM70-314-310B1-314-0.5mm, part Q) Apalis - CAN; 17 of 25

### Library data of the parts
C1-C4 = C-X7R-100nF-16V-10%-0603: Capacitor Ceramic X7R 100nF 16V 10% 0603; Tolerance: 10%; Type: X7R; Value: 100nF
C5 = C-4.7uF-16V-10%-3216-TA: Capacitor TA 4.7uF 16V 10% 3216; Tolerance: 10%; Type: TA; Value: 4.7uF
C6 = C-1uF-16V-10%-3216-TA: Capacitor TA 1uF 16V 10% 3216; Tolerance: 10%; Type: TA; Value: 1uF
C7 = C-100nF-16V-10%-0603-X7R: Capacitor Ceramic X7R 100nF 16V 10% 0603; Tolerance: 10%; Type: X7R; Value: 100nF
C170 C171 = C-100nF-50V-20%-0603-X7R: Capacitor Ceramic X7R 100nF 50V 20% 0603; Tolerance: 20%; Type: X7R; Value: 100nF
IC1 IC3 = IC-MC-MCP2551T-I/SN: High speed CAN Transceiver; Manufacturer Name: Microchip; Manufacturer Part No.: MCP2551T-I/SN
IC2 = IC-AD-ADuM1402ARWZ: Digital Isolator
IC4 = IC-MORNSUN-B0505XT-SMD: MORNSUN Isolated DC/DC Converter; Manufacturer Name: Murata
L1 = L-220R@100MHz-2A-25%-0603: as L18 on sheet 1_Power_Supply; Rating: 2A; Value: 220R@100MHz
LED1-LED4 = LED: 0805LED绿
P1 P2 = CON-TECon-8Header: 网口
R1 R7 = R-0R-63mW-1%-0603: Resistor 0 ohm 63mW 1% 0603; Rating: 63mW; Tolerance: 1%; Value: 0R
R2 R3 R5 R6 = R-100KR-63mW-5%-0603: as R35 on sheet 2_Power_Switch; Rating: 63mW; Tolerance: 5%
R4 R8 = R-120R-250mW-5%-0603: Resistor 120 ohm 250mW 5% 0603; Rating: 250mW; Tolerance: 5%; Value: 120R
R142 R143 = R-120R-63mW-5%-0603: Resistor 120 ohm 63mW 5% 0603; Rating: 63mW; Tolerance: 5%; Value: 100R
RA1 = RA-22R-63mW-5%-1206-div: Resistor Array 22 R 63mW 5% 1206; Tolerance: 5%; Power Dissipation: 63mW; Value: 22R
TP601 TP602 = Testpin: Testpin TH
X1 = CON-JAE-MM70-314-310B1-314-0.5mm: as X1 on sheet 1_Power_Supply

## Sheet 7_UART&RS485.SchDoc: Apalis Evaluation Board 1.1
size A3; Organization: Toradex AG; Address1: Altsagenstrasse 5; Address2: Horw; Address3: 6048; Address4: Switzerland; DocumentNumber: 24; Revision: V1.1; SheetNumber: 24; SheetTotal: 32; PageSetup: Record=PageOptions|CenterHorizontal=True|CenterVertical=True|PrintScale=0.73|XCorrection=1.00|YCorrection=1.00|PrintKind=0|BorderSize=5000000|LeftOffset=0|BottomOffset=0|Orientation=2|PaperLength=1000|PaperWidth=1000|Scale=100|PaperSource=7|PrintQuality=-4|MediaType=1|DitherType=10|PaperKind=A4|PrintScaleMode=1
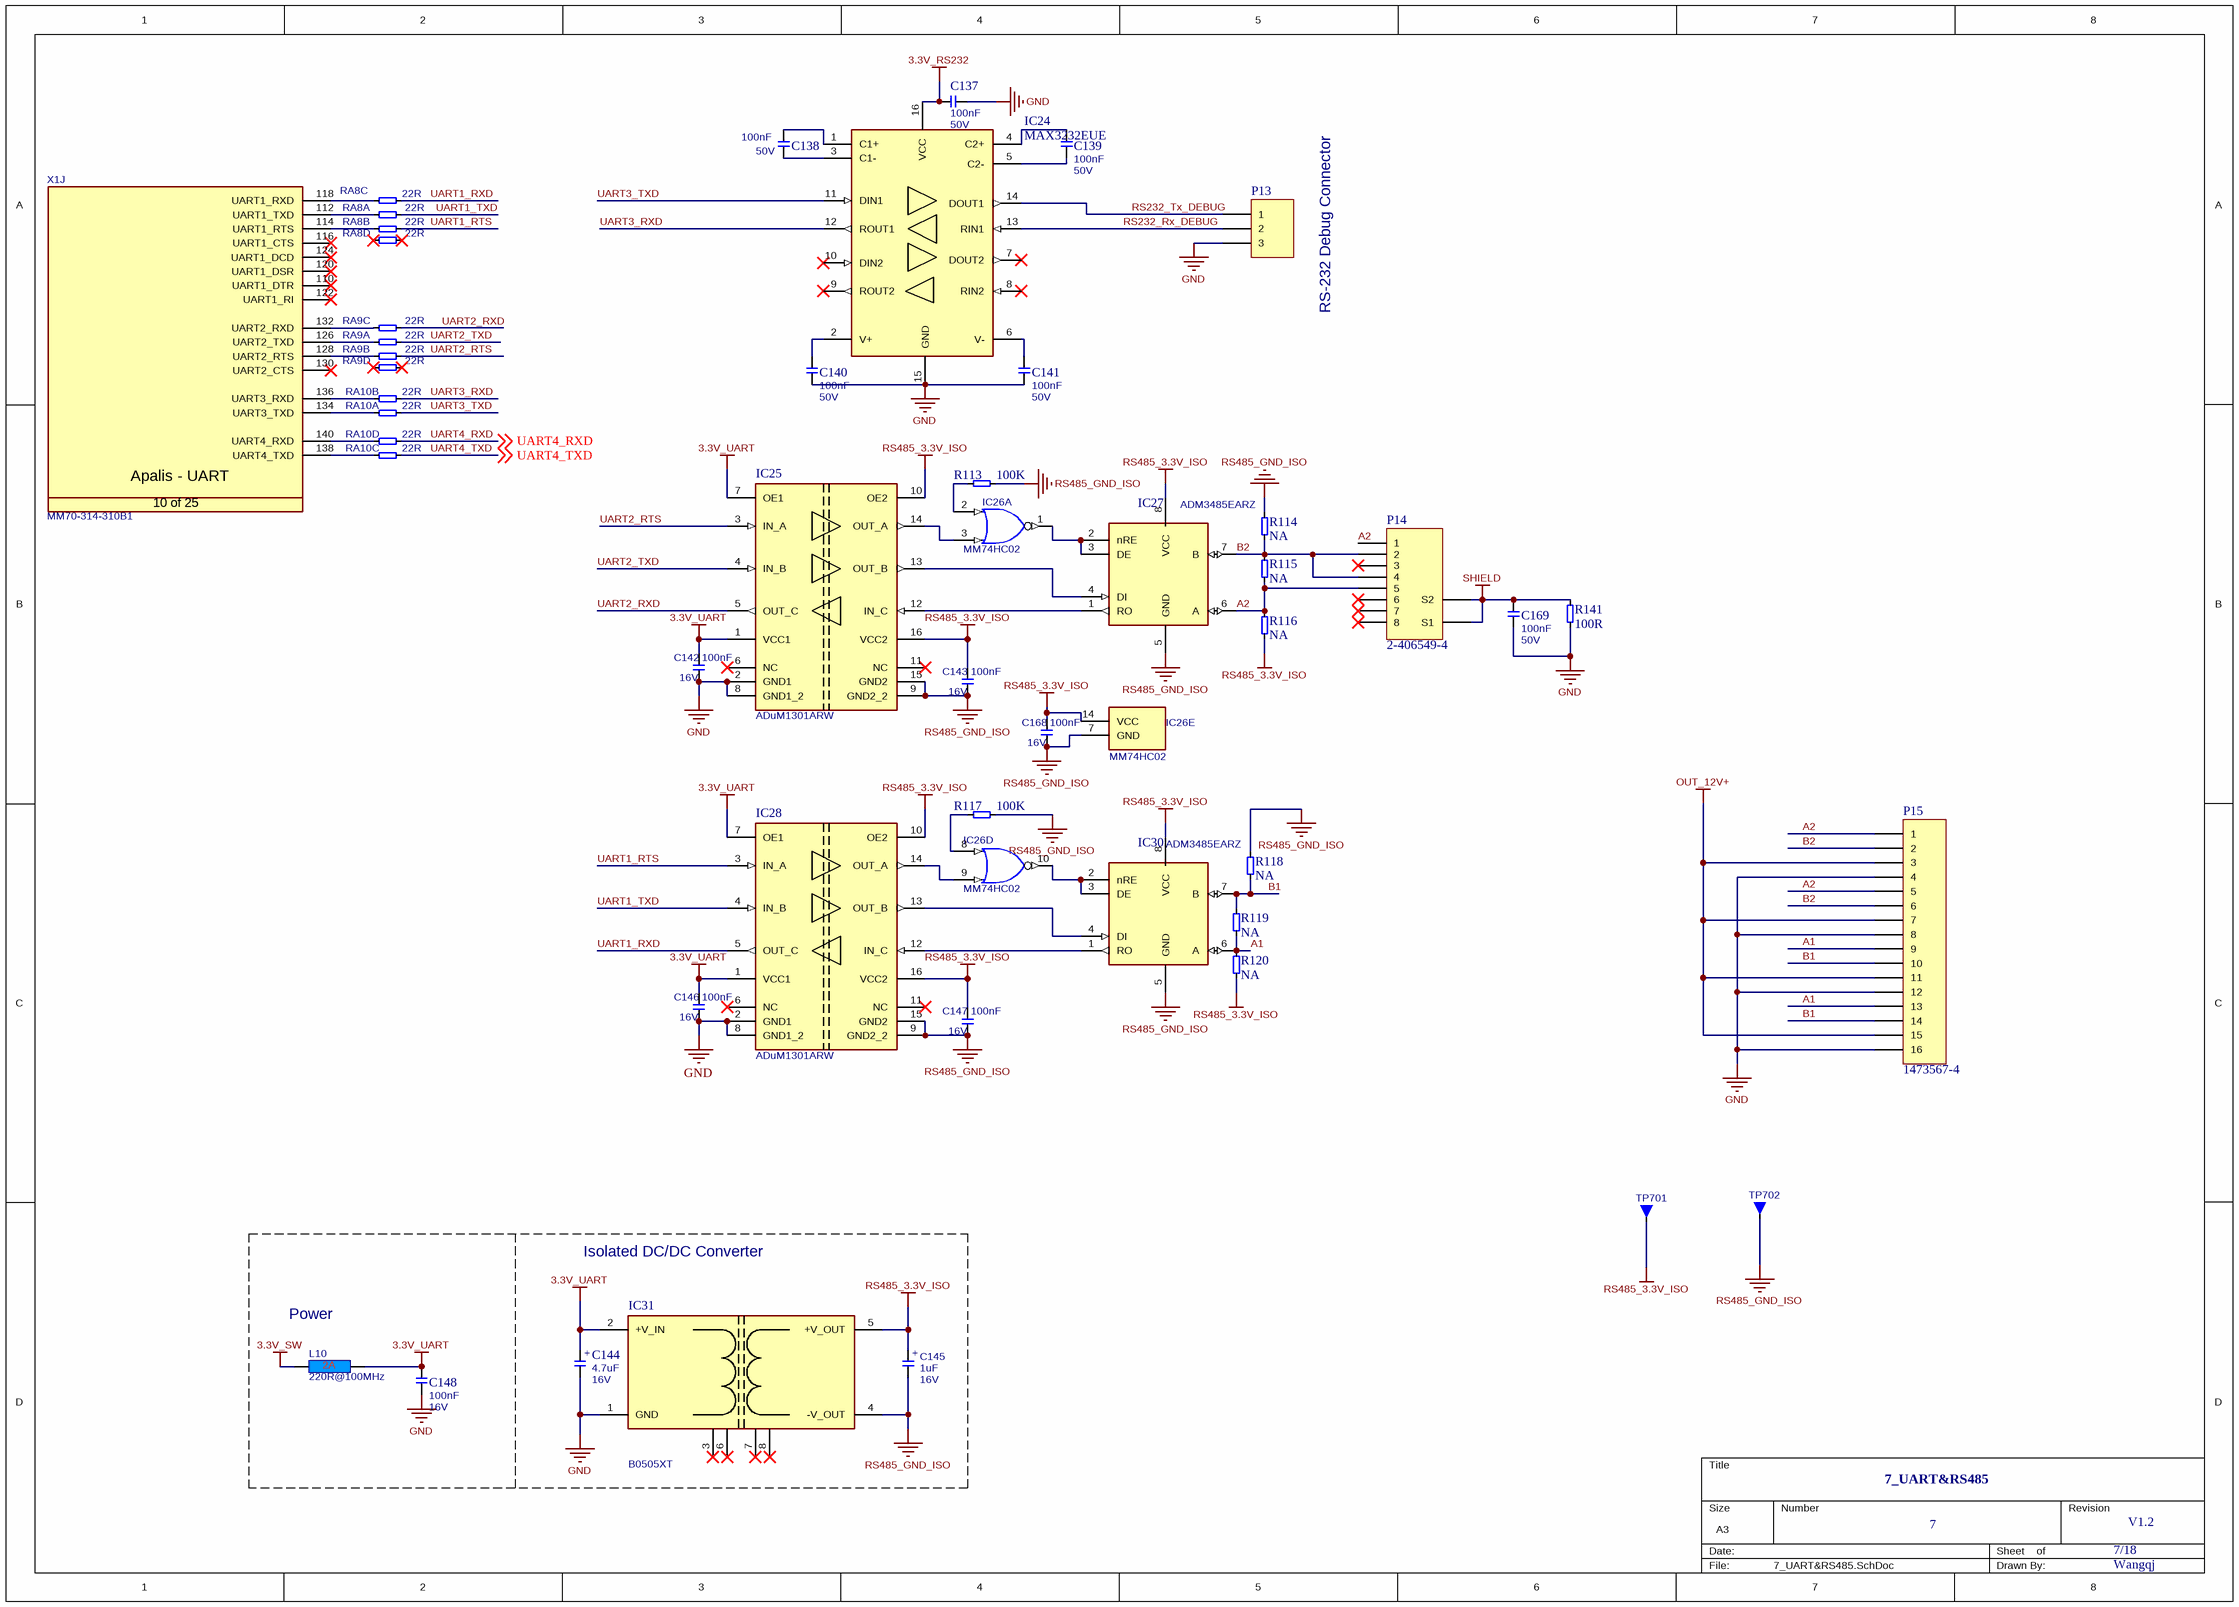
[diagram p6: 7_UART&RS485.SchDoc]

### Parts
C137  Rating: 50V  [T_CAPC0603X33N]  (hidden comment: 100nF)
C138  Rating: 50V  [T_CAPC0603X33N]  (hidden comment: 100nF)
C139  Rating: 50V  [T_CAPC0603X33N]  (hidden comment: 100nF)
C140  Rating: 50V  [T_CAPC0603X33N]  (hidden comment: 100nF)
C141  Rating: 50V  [T_CAPC0603X33N]  (hidden comment: 100nF)
C142  Rating: 16V  [T_CAPC0603X33N]  (hidden comment: 100nF)
C143  Rating: 16V  [T_CAPC0603X33N]  (hidden comment: 100nF)
C144  Rating: 16V  [T_CAPMP3216X180N]  (hidden comment: 4.7uF)
C145  Rating: 16V  [T_CAPMP3216X180N]  (hidden comment: 1uF)
C146  Rating: 16V  [T_CAPC0603X33N]  (hidden comment: 100nF)
C147  Rating: 16V  [T_CAPC0603X33N]  (hidden comment: 100nF)
C148  Rating: 16V  [T_CAPC0603X33N]  (hidden comment: 100nF)
C168  Rating: 16V  [T_CAPC0603X33N]  (hidden comment: 100nF)
C169  Rating: 50V  [T_CAPC0603X33N]  (hidden comment: 100nF)
IC24  MAX3232EUE  [LC-TSSOP-16]
IC25  ADuM1301ARW  [T_AD_ADuM1300ARW]
IC26  MM74HC02  [T_ST_M74HC02TTR]  (parts A,D,E of 5)
IC27  ADM3485EARZ  [LC-SOIC-8_150mil]
IC28  ADuM1301ARW  [T_AD_ADuM1300ARW]
IC30  ADM3485EARZ  [LC-SOIC-8_150mil]
IC31  Manufacturer Part No.: B0505XT  [MORNSUN_B0305XT-1W_SMD]  (hidden comment: B0505XT-1W)
L10  220R@100MHz  [INDC1608X95N]
P13  (no value)  [2.54*3P]
P14  2-406549-4  [RJ45卡口朝上]
P15  1473567-4  [147-4]
R113  100K  [T_RESC0603X30N]
R114  NA  [T_RESC0603X30N]
R115  NA  [T_RESC0603X30N]
R116  NA  [T_RESC0603X30N]
R117  100K  [T_RESC0603X30N]
R118  NA  [T_RESC0603X30N]
R119  NA  [T_RESC0603X30N]
R120  NA  [T_RESC0603X30N]
R141  100R  [T_RESC0603X30N]
RA8  22R  [T_Resistor_Array_X4]  (parts A,B,C,D of 4)
RA9  22R  [T_Resistor_Array_X4]  (parts A,B,C,D of 4)
RA10  22R  [T_Resistor_Array_X4]  (parts A,B,C,D of 4)
TP701  Testpin  [T_TP-THT]  (value not drawn)
TP702  Testpin  [T_TP-THT]  (value not drawn)
X1  Manufacturer Part No.: MM70-314-310B1  [T_JAE_MM70-314-310B1]  (hidden comment: CON-JAE-MM70-314-310B1-314-0.5mm)  (part J of 25)

### Nets
3.3V_RS232: C137.2 IC24.16(VCC)
3.3V_SW: L10.1
3.3V_UART: C142.2 C144.1 C146.2 C148.2 IC25.1(VCC1) IC25.7(OE1) IC28.1(VCC1) IC28.7(OE1) IC31.2(+V_IN) L10.2
GND: C137.1 C140.1 C141.1 C142.1 C144.2 C146.1 C148.1 C169.1 IC24.15(GND) IC25.2(GND1) IC25.8(GND1_2) IC28.2(GND1) IC28.8(GND1_2) IC31.1(GND) P13.3 P15.4 P15.8 P15.12 P15.16 R141.1
OUT_12V+: P15.3 P15.7 P15.11 P15.15
RS485_3.3V_ISO: C143.2 C145.1 C147.2 C168.2 IC25.10(OE2) IC25.16(VCC2) IC26.14(VCC) IC27.8(VCC) IC28.10(OE2) IC28.16(VCC2) IC30.8(VCC) IC31.5(+V_OUT) R116.1 R120.1 TP701.1
RS485_GND_ISO: C143.1 C145.2 C147.1 C168.1 IC25.9(GND2_2) IC25.15(GND2) IC26.7(GND) IC27.5(GND) IC28.9(GND2_2) IC28.15(GND2) IC30.5(GND) IC31.4(-V_OUT) R113.2 R114.2 R117.2 R118.2 TP702.1
SHIELD: C169.2 P14.S1 P14.S2 R141.2
A1: IC30.6(A) P15.9 P15.13 R119.1 R120.2
A2: IC27.6(A) P14.1 P14.5 P15.1 P15.5 R115.1 R116.2
B1: IC30.7(B) P15.10 P15.14 R118.1 R119.2
B2: IC27.7(B) P14.2 P14.4 P15.2 P15.6 R114.1 R115.2
RS232_Rx_DEBUG: IC24.13(RIN1) P13.2
RS232_Tx_DEBUG: IC24.14(DOUT1) P13.1
UART1_RTS: IC28.3(IN_A) RA8.6
UART1_RXD: IC28.5(OUT_C) RA8.7
UART1_TXD: IC28.4(IN_B) RA8.5
UART2_RTS: IC25.3(IN_A) RA9.6
UART2_RXD: IC25.5(OUT_C) RA9.7
UART2_TXD: IC25.4(IN_B) RA9.5
UART3_RXD: IC24.12(ROUT1) RA10.6
UART3_TXD: IC24.11(DIN1) RA10.5
UART4_RXD: RA10.8 ; off-sheet UART4_RXD  [project net BC20_RXD]
UART4_TXD: RA10.7 ; off-sheet UART4_TXD  [project net BC20_TXD]
NetC138_1: C138.1 IC24.3(C1-)
NetC138_2: C138.2 IC24.1(C1+)
NetC139_1: C139.1 IC24.5(C2-)
NetC139_2: C139.2 IC24.4(C2+)
NetC140_2: C140.2 IC24.2(V+)
NetC141_2: C141.2 IC24.6(V-)
NetIC25_12: IC25.12(IN_C) IC27.1(RO)
NetIC25_13: IC25.13(OUT_B) IC27.4(DI)
NetIC25_14: IC25.14(OUT_A) IC26.3(B)
NetIC26_1: IC26.1(~{O}) IC27.2(nRE) IC27.3(DE)
NetIC26_2: IC26.2(A) R113.1
NetIC26_8: IC26.8(A) R117.1
NetIC26_9: IC26.9(B) IC28.14(OUT_A)
NetIC26_10: IC26.10(~{O}) IC30.2(nRE) IC30.3(DE)
NetIC28_12: IC28.12(IN_C) IC30.1(RO)
NetIC28_13: IC28.13(OUT_B) IC30.4(DI)
NetRA8_1: RA8.1 X1.112(UART1_TXD)
NetRA8_2: RA8.2 X1.114(UART1_RTS)
NetRA8_3: RA8.3 X1.118(UART1_RXD)
NetRA9_1: RA9.1 X1.126(UART2_TXD)
NetRA9_2: RA9.2 X1.128(UART2_RTS)
NetRA9_3: RA9.3 X1.132(UART2_RXD)
NetRA10_1: RA10.1 X1.134(UART3_TXD)
NetRA10_2: RA10.2 X1.136(UART3_RXD)
NetRA10_3: RA10.3 X1.138(UART4_TXD)
NetRA10_4: RA10.4 X1.140(UART4_RXD)

Not connected (* = marked no-connect by the designer): IC24 7(DOUT2)* 8(RIN2)* 9(ROUT2)* 10(DIN2)*; IC25 6(NC)* 11(NC)*; IC28 6(NC)* 11(NC)*; IC31 3(NC)* 6(NC)* 7(NC)* 8(NC)*; P14 3* 6* 7* 8*; RA8 4* 8*; RA9 4* 8*; X1 110(UART1_DTR)* 116(UART1_CTS)* 120(UART1_DSR)* 122(UART1_RI)* 124(UART1_DCD)* 130(UART2_CTS)*

### Notes on the sheet
- RS-232 Debug Connector
- Isolated DC/DC Converter
- (near L10) Power
- 7_UART&RS485
- 7
- 7/18
- V1.2
- Wangqj
- Title
- Size:
- Date:
- A3
- Number:
- Time:
- Revision:
- Sheet
- of
- File:
- (in symbol C-1uF-16V-10%-3216-TA) +
- (in symbol C-4.7uF-16V-10%-3216-TA) +
- (in symbol CON-JAE-MM70-314-310B1-314-0.5mm, part J) Apalis - UART; 10 of 25

### Library data of the parts
C137-C141 = C-X7R-100nF-50V-20%-0603: Capacitor Ceramic X7R 100nF 50V 20% 0603; Tolerance: 20%; Type: X7R; Value: 100nF
C142 C143 C146 C147 C168 = C-X7R-100nF-16V-10%-0603: Capacitor Ceramic X7R 100nF 16V 10% 0603; Tolerance: 10%; Type: X7R; Value: 100nF
C144 = C-4.7uF-16V-10%-3216-TA: Capacitor TA 4.7uF 16V 10% 3216; Tolerance: 10%; Type: TA; Value: 4.7uF
C145 = C-1uF-16V-10%-3216-TA: Capacitor TA 1uF 16V 10% 3216; Tolerance: 10%; Type: TA; Value: 1uF
C148 = C-100nF-16V-10%-0603-X7R: Capacitor Ceramic X7R 100nF 16V 10% 0603; Tolerance: 10%; Type: X7R; Value: 100nF
C169 = C-100nF-50V-20%-0603-X7R: Capacitor Ceramic X7R 100nF 50V 20% 0603; Tolerance: 20%; Type: X7R; Value: 100nF
IC24 = IC-MAXIM-MAX3232: RS232
IC25 IC28 = IC-AD-ADuM1301ARW: Digital Isolator; Manufacturer Name: Analog Devices; Manufacturer Part No.: ADuM1301ARW
IC26 = IC-ST-M74HC02TTR: Quad 2-Input NOR Gate; Manufacturer Name: ON Semiconductor; Manufacturer part No.: MM74HC02
IC27 IC30 = IC-AD-ADM3485EARZ: ADM3485EARZ RS-485/RS-422 transceiver; Manufacturer Name: Analog Devices; Manufacturer Part No.: ADM3485EARZ
IC31 = IC-MORNSUN-B0505XT-SMD: as IC4 on sheet 6_CAN
L10 = L-220R@100MHz-2A-25%-0603: as L18 on sheet 1_Power_Supply; Rating: 2A; Value: 220R@100MHz
P13 = Header 3: Header, 3-Pin; LatestRevisionDate: 17-Jul-2002; LatestRevisionNote: Re-released for DXP Platform.; Publisher: Altium Limited
P14 = CON-TECon-8Header: 网口
P15 = Header 16H: 泰科4p端子; LatestRevisionDate: 17-Jul-2002; LatestRevisionNote: Re-released for DXP Platform.; Publisher: Altium Limited
R113 R117 = R-100KR-63mW-5%-0603: as R35 on sheet 2_Power_Switch; Rating: 63mW; Tolerance: 5%
R114-R116 R118-R120 = R-NA-63mW-0603: Resistor NA 63mW  0603; Tolerance: 1%; Rating: 63mW; Value: NA
R141 = R-120R-63mW-5%-0603: Resistor 120 ohm 63mW 5% 0603; Rating: 63mW; Tolerance: 5%; Value: 100R
RA8-RA10 = RA-22R-63mW-5%-1206-div: Resistor Array 22 R 63mW 5% 1206; Tolerance: 5%; Power Dissipation: 63mW; Value: 22R
TP701 TP702 = Testpin: Testpin TH
X1 = CON-JAE-MM70-314-310B1-314-0.5mm: as X1 on sheet 1_Power_Supply

## Sheet 8_USB_Hub.SchDoc: Apalis Evaluation Board 1.1
size A3; Organization: Toradex AG; Address1: Altsagenstrasse 5; Address2: Horw; Address3: 6048; Address4: Switzerland; DocumentNumber: 6; Revision: V1.1; SheetNumber: 6; SheetTotal: 32; PageSetup: Record=PageOptions|CenterHorizontal=True|CenterVertical=True|PrintScale=0.71|XCorrection=1.00|YCorrection=1.00|PrintKind=0|BorderSize=5000000|LeftOffset=0|BottomOffset=0|Orientation=2|PaperLength=1000|PaperWidth=1000|Scale=100|PaperSource=7|PrintQuality=-4|MediaType=1|DitherType=10|PaperKind=A4|PrintScaleMode=1
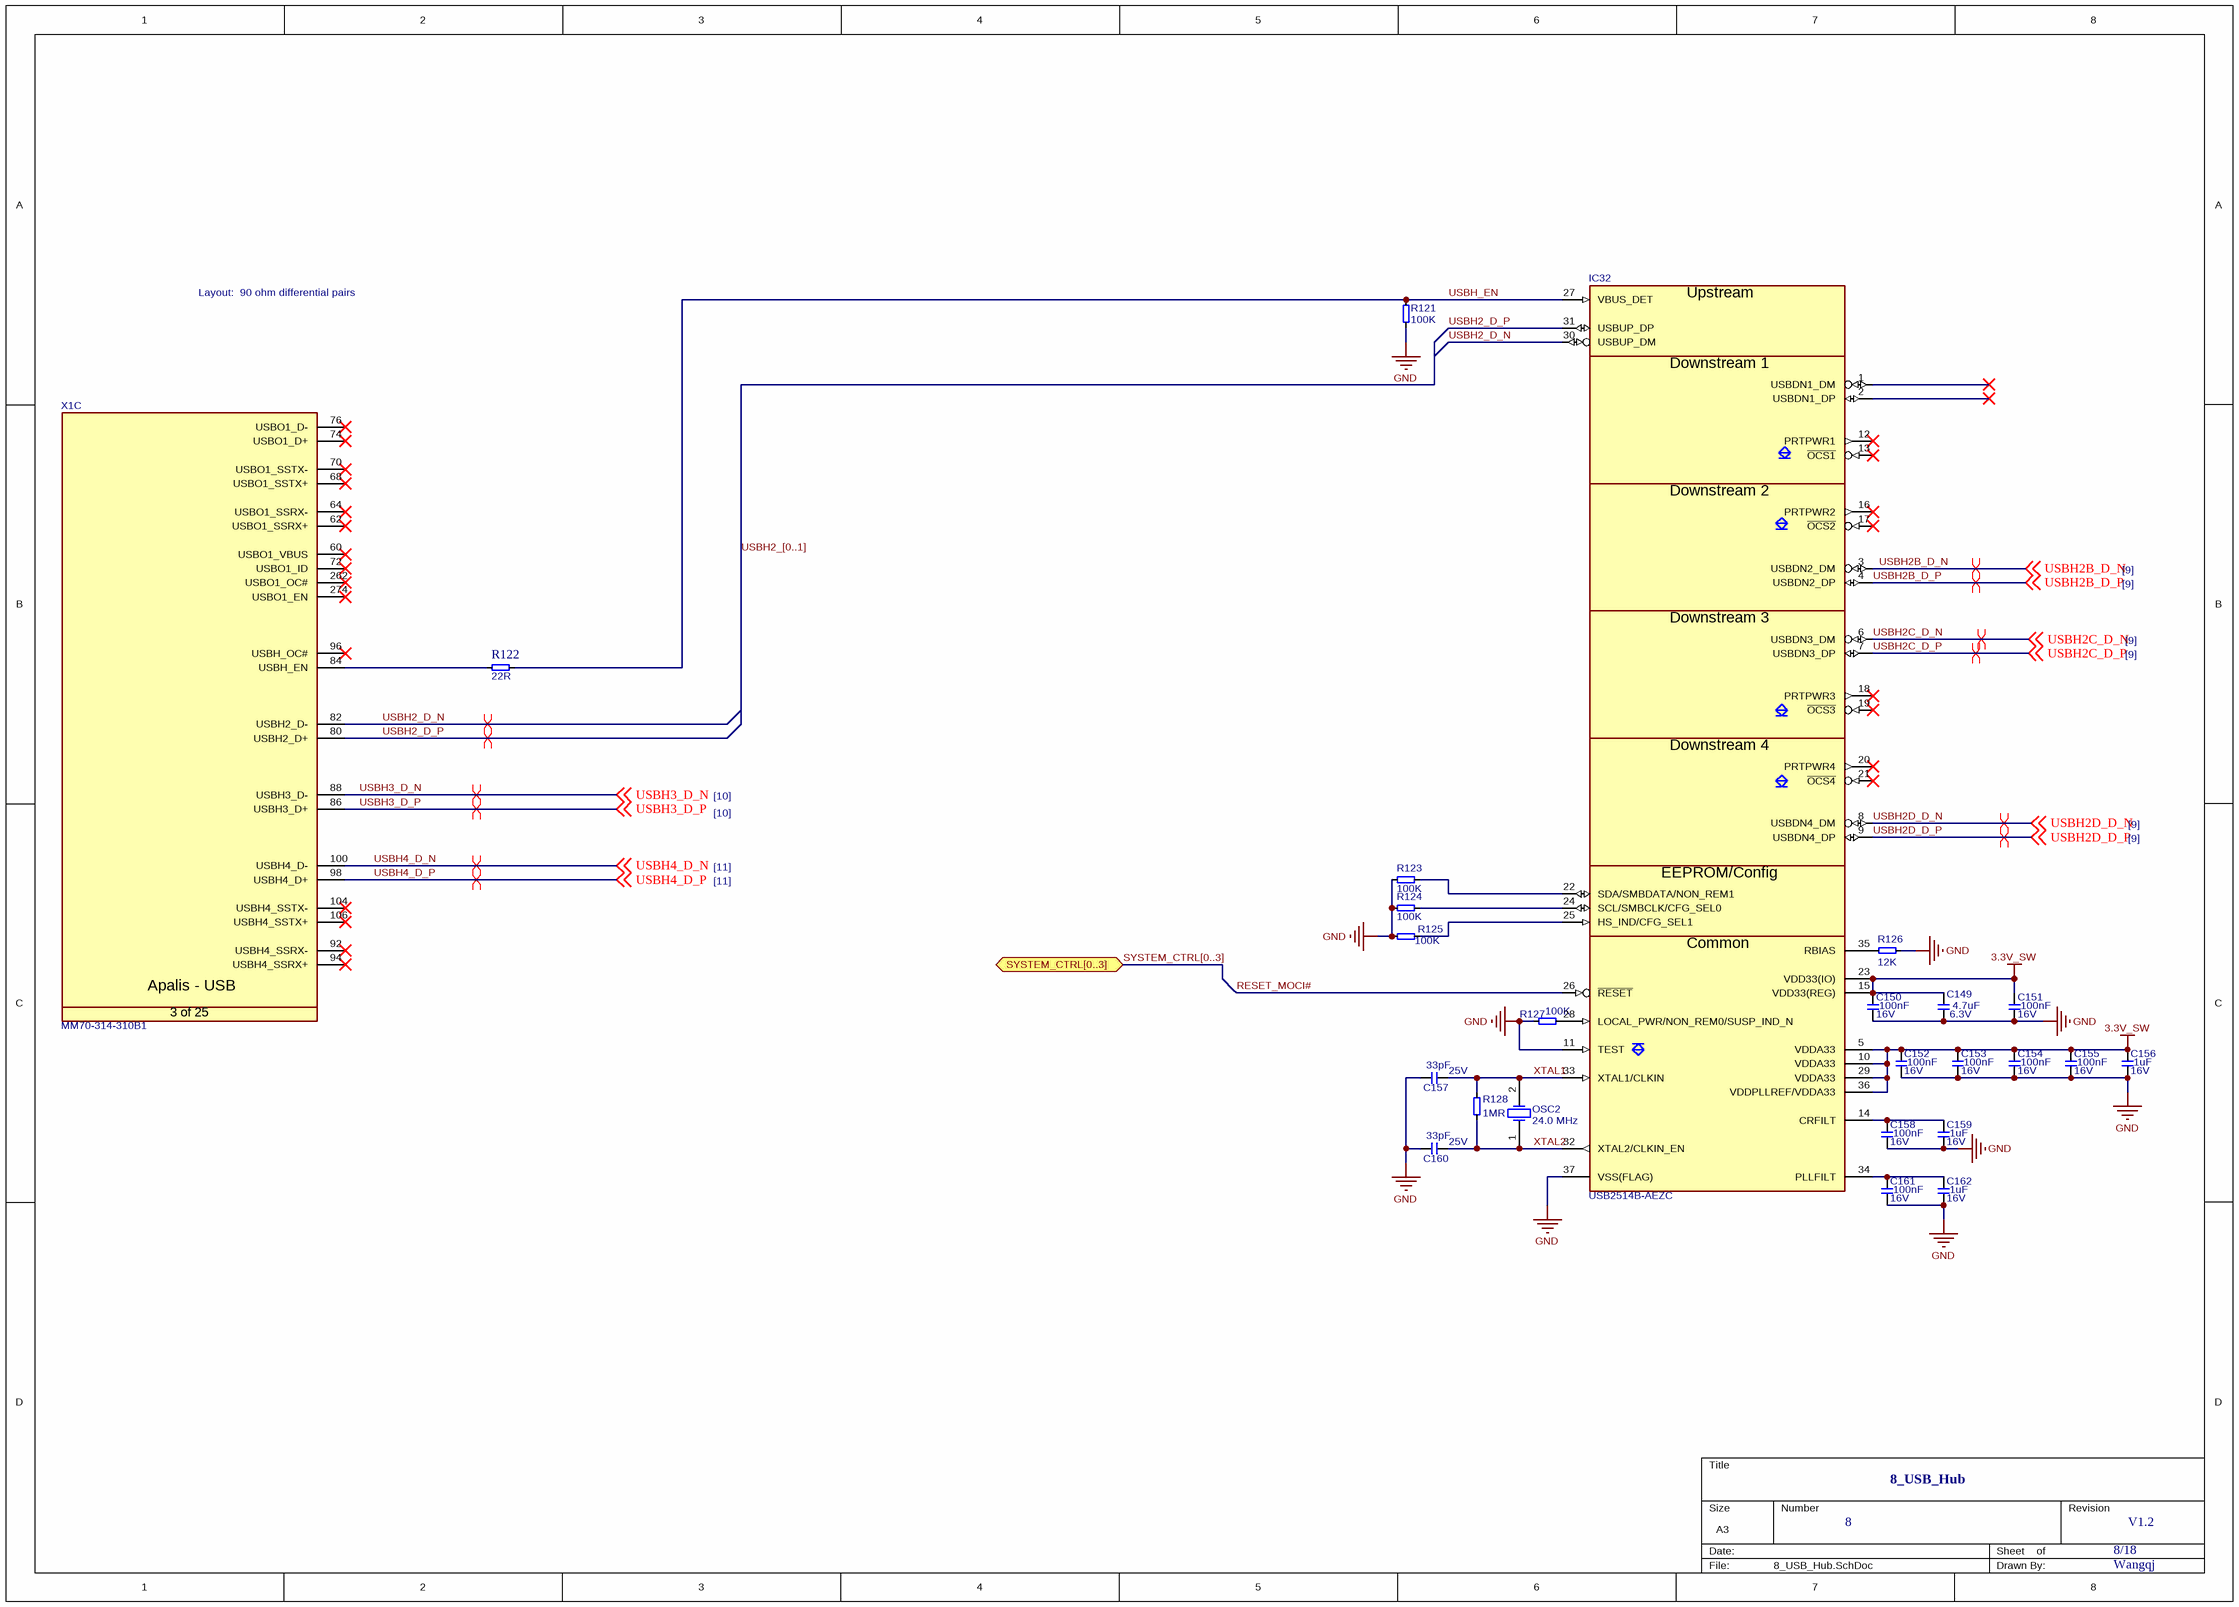
[diagram p7: 8_USB_Hub.SchDoc]

### Parts
C149  Rating: 6.3V  [T_CAPC0603X33N]  (hidden comment: 4.7uF)
C150  Rating: 16V  [T_CAPC0603X33N]  (hidden comment: 100nF)
C151  Rating: 16V  [T_CAPC0603X33N]  (hidden comment: 100nF)
C152  Rating: 16V  [T_CAPC0603X33N]  (hidden comment: 100nF)
C153  Rating: 16V  [T_CAPC0603X33N]  (hidden comment: 100nF)
C154  Rating: 16V  [T_CAPC0603X33N]  (hidden comment: 100nF)
C155  Rating: 16V  [T_CAPC0603X33N]  (hidden comment: 100nF)
C156  Rating: 16V  [T_CAPC0603X33N]  (hidden comment: 1uF)
C157  Rating: 25V  [T_CAPC0603X33N]  (hidden comment: 33pF)
C158  Rating: 16V  [T_CAPC0603X33N]  (hidden comment: 100nF)
C159  Rating: 16V  [T_CAPC0603X33N]  (hidden comment: 1uF)
C160  Rating: 25V  [T_CAPC0603X33N]  (hidden comment: 33pF)
C161  Rating: 16V  [T_CAPC0603X33N]  (hidden comment: 100nF)
C162  Rating: 16V  [T_CAPC0603X33N]  (hidden comment: 1uF)
IC32  Manufacturer Part No.: USB2514B-AEZC  [T_SMSC_USB2514B-AEZC]  (hidden comment: USB2514B)
OSC2  value 24.0 MHz  [SMD-5032_2P]  (hidden comment: HEX24-24000MHz-18-50R-F-H2-T2-W2-T)
R121  100K  [T_RESC0603X30N]
R122  22R  [T_RESC0603X30N]
R123  100K  [T_RESC0603X30N]
R124  100K  [T_RESC0603X30N]
R125  100K  [T_RESC0603X30N]
R126  12K  [T_RESC0603X30N]
R127  100K  [T_RESC0603X30N]
R128  1MR  [T_RESC0603X30N]
X1  Manufacturer Part No.: MM70-314-310B1  [T_JAE_MM70-314-310B1]  (hidden comment: CON-JAE-MM70-314-310B1-314-0.5mm)  (part C of 25)

### Ports
SYSTEM_CTRL[0..3] (bidir)

### Nets
3.3V_SW: C149.2 C150.2 C151.2 C152.2 C153.2 C154.2 C155.2 C156.2 IC32.5(VDDA33) IC32.10(VDDA33) IC32.15(VDD33(REG)) IC32.23(VDD33(IO)) IC32.29(VDDA33) IC32.36(VDDPLLREF/VDDA33)
GND: C149.1 C150.1 C151.1 C152.1 C153.1 C154.1 C155.1 C156.1 C157.1 C158.1 C159.1 C160.1 C161.1 C162.1 IC32.11(TEST) IC32.37(VSS(FLAG)) R121.1 R123.2 R124.2 R125.2 R126.1 R127.1
RESET_MOCI#: IC32.26(~{RESET})  [project net MXM3_26]
USBH2_D_N: IC32.30(USBUP_DM) X1.82(USBH2_D-)
USBH2_D_P: IC32.31(USBUP_DP) X1.80(USBH2_D+)
USBH2B_D_N: IC32.3(USBDN2_DM) ; off-sheet USBH2B_D_N
USBH2B_D_P: IC32.4(USBDN2_DP) ; off-sheet USBH2B_D_P
USBH2C_D_N: IC32.6(USBDN3_DM) ; off-sheet USBH2C_D_N
USBH2C_D_P: IC32.7(USBDN3_DP) ; off-sheet USBH2C_D_P
USBH2D_D_N: IC32.8(USBDN4_DM) ; off-sheet USBH2D_D_N
USBH2D_D_P: IC32.9(USBDN4_DP) ; off-sheet USBH2D_D_P
USBH3_D_N: X1.88(USBH3_D-) ; off-sheet USBH3_D_N
USBH3_D_P: X1.86(USBH3_D+) ; off-sheet USBH3_D_P
USBH4_D_N: X1.100(USBH4_D-) ; off-sheet USBH4_D_N
USBH4_D_P: X1.98(USBH4_D+) ; off-sheet USBH4_D_P
USBH_EN: IC32.27(VBUS_DET) R121.2 R122.2
XTAL1: C157.2 IC32.33(XTAL1/CLKIN) OSC2.2(OSC2) R128.2
XTAL2: C160.2 IC32.32(XTAL2/CLKIN_EN) OSC2.1(OSC1) R128.1
NetC158_2: C158.2 C159.2 IC32.14(CRFILT)
NetC161_2: C161.2 C162.2 IC32.34(PLLFILT)
NetIC32_22: IC32.22(SDA/SMBDATA/NON_REM1) R123.1
NetIC32_24: IC32.24(SCL/SMBCLK/CFG_SEL0) R124.1
NetIC32_25: IC32.25(HS_IND/CFG_SEL1) R125.1
NetIC32_28: IC32.28(LOCAL_PWR/NON_REM0/SUSP_IND_N) R127.2
NetIC32_35: IC32.35(RBIAS) R126.2
NetR122_1: R122.1 X1.84(USBH_EN)

Not connected (* = marked no-connect by the designer): IC32 1(USBDN1_DM)* 2(USBDN1_DP)* 12(PRTPWR1)* 13(~{OCS1})* 16(PRTPWR2)* 17(~{OCS2})* 18(PRTPWR3)* 19(~{OCS3})* 20(PRTPWR4)* 21(~{OCS4})*; X1 60(USBO1_VBUS)* 62(USBO1_SSRX+)* 64(USBO1_SSRX-)* 68(USBO1_SSTX+)* 70(USBO1_SSTX-)* 72(USBO1_ID)* 74(USBO1_D+)* 76(USBO1_D-)* 92(USBH4_SSRX-)* 94(USBH4_SSRX+)* 96(USBH_OC#)* 104(USBH4_SSTX-)* 106(USBH4_SSTX+)* 262(USBO1_OC#)* 274(USBO1_EN)*

### Buses and harness runs
bus SYSTEM_CTRL[0..3] = port SYSTEM_CTRL[0..3]
bus USBH2_[0..1]

### Layout directives
differential pair: USBH2_D_N, USBH2_D_P, USBH2B_D_N, USBH2B_D_P, USBH2C_D_N, USBH2C_D_P, USBH2D_D_N, USBH2D_D_P, USBH3_D_N, USBH3_D_P, USBH4_D_N, USBH4_D_P

### Notes on the sheet
- Layout:  90 ohm differential pairs
- [9]
- [10]
- [11]
- 8_USB_Hub
- 8
- 8/18
- V1.2
- Wangqj
- Title
- Size:
- Date:
- A3
- Number:
- Time:
- Revision:
- Sheet
- of
- File:
- (in symbol CON-JAE-MM70-314-310B1-314-0.5mm, part C) Apalis - USB; 3 of 25
- (in symbol IC-SMSC-USB2514B-AEZC) Upstream; Downstream 1; Downstream 2; Downstream 3; Downstream 4; EEPROM/Config; Common

### Library data of the parts
C149 = C-X5R-4.7uF-6.3V-20%-0603: Capacitor Ceramic X5R 4.7uF 6.3V 20% 0603; Tolerance: 20%; Type: X5R; Value: 4.7uF
C150-C155 C158 C161 = C-X7R-100nF-16V-10%-0603: Capacitor Ceramic X7R 100nF 16V 10% 0603; Tolerance: 10%; Type: X7R; Value: 100nF
C156 C159 C162 = C-X5R-1uF-16V-20%-0603: Capacitor Ceramic X5R 1uF 16V 20% 0603; Tolerance: 20%; Type: X5R; Value: 1uF
C157 C160 = C-NP0-33pF-25V-10%-0603: Capacitor Ceramic NP0 33pF 25V 10% 0603; Tolerance: 10%; Type: NP0; Value: 33pF
IC32 = IC-SMSC-USB2514B-AEZC: 4 Port USB HUB; Manufacturer Name: SMSC
OSC2 = OSC-HORIZON-HEX24-24000MHz-18-50R-F-H2-T2-W2-T: Quartz 24.0 MHz; Tolerance: 30ppm; Manufacturer Name: HORIZON; Manufacturer Part No.: HEX24-24000MHz-18-50R-F-H2-T2-W2-T
R121 R123-R125 R127 = R-100KR-63mW-5%-0603: as R35 on sheet 2_Power_Switch; Rating: 63mW; Tolerance: 5%
R122 = R-22R-63mW-5%-0603: Resistor 22 ohm 63mW 5% 0603; Rating: 63mW; Tolerance: 5%; Value: 22R
R126 = R-12KR-63mW-1%-0603: Resistor 12 Kohm 63mW 1% 0603; Value: 12KR; Rating: 63mW; Tolerance: 1%
R128 = R-1MR-63mW-5%-0603: Resistor 1Mohm 63mW 5% 0603; Rating: 63mW; Tolerance: 5%; Value: 1MR
X1 = CON-JAE-MM70-314-310B1-314-0.5mm: as X1 on sheet 1_Power_Supply